# EasyEDA Pro project ESP32S3系统板+扩展板.epro

# Schematic Schematic1
Board Name: Board1; Create Date: 2025-07-21; Page Name: P1; Project Name: ESP32S3开发板; Schematic Name: Schematic1; Update Date: 2025-07-21; Company: 嘉立创EDA; Page Size: A4; Version: V1.0
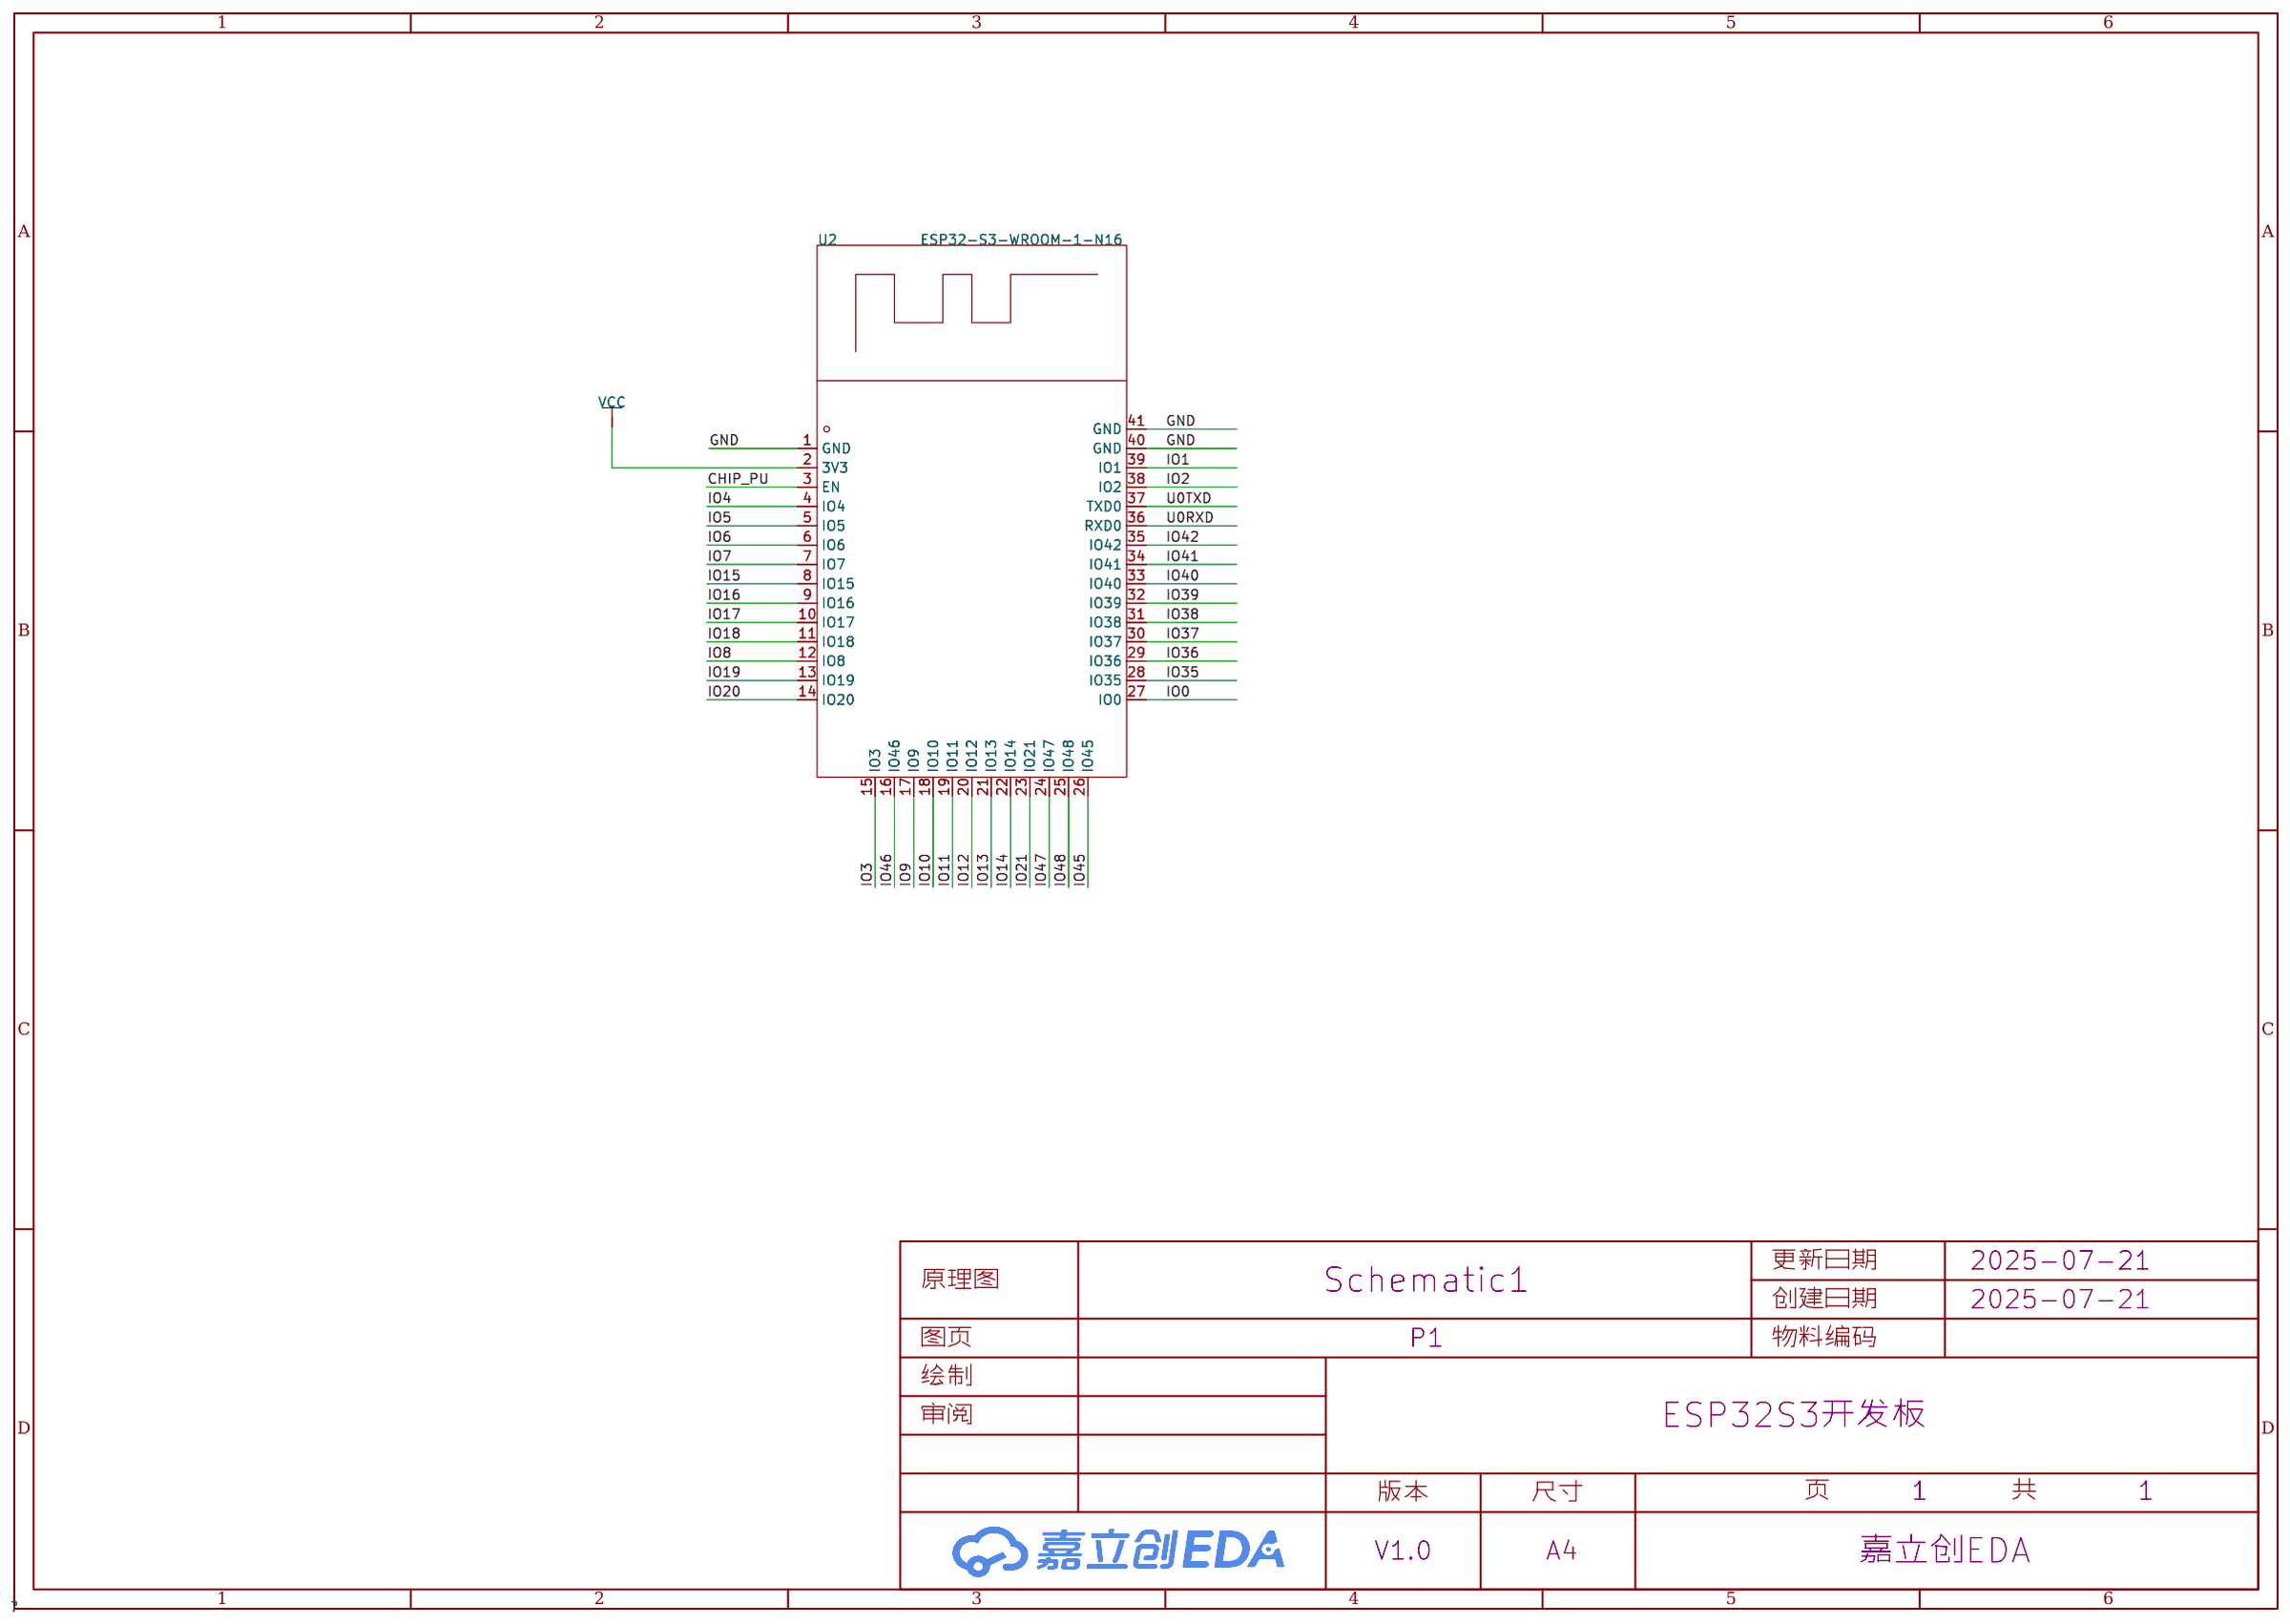
[diagram p0: schematic sheet]

## Parts
U2  ESP32-S3-WROOM-1-N16  [WIRELM-SMD_ESP32-S3-WROOM-1]

## Library data of the parts
U2 = ESP32-S3-WROOM-1-N16: LCSC Part Name: 通用型Wi-Fi+低功耗蓝牙MCU模组; Supplier Part: C2913199; Manufacturer: ESPRESSIF(乐鑫); Supplier Footprint: SMD,18x25.5mm; JLCPCB Part Class: 扩展库; Datasheet: https://atta.szlcsc.com/upload/public/pdf/source/20241030/6A412B13087E1327DF6279F5735253CA.pdf; Supplier: LCSC

## Nets
GND: U2.1(GND) U2.40(GND) U2.41(GND)
VCC: U2.2(3V3)
CHIP_PU: U2.3(EN)
IO0: U2.27(IO0)
IO1: U2.39(IO1)
IO2: U2.38(IO2)
IO3: U2.15(IO3)
IO4: U2.4(IO4)
IO5: U2.5(IO5)
IO6: U2.6(IO6)
IO7: U2.7(IO7)
IO8: U2.12(IO8)
IO9: U2.17(IO9)
IO10: U2.18(IO10)
IO11: U2.19(IO11)
IO12: U2.20(IO12)
IO13: U2.21(IO13)
IO14: U2.22(IO14)
IO15: U2.8(IO15)
IO16: U2.9(IO16)
IO17: U2.10(IO17)
IO18: U2.11(IO18)
IO19: U2.13(IO19)
IO20: U2.14(IO20)
IO21: U2.23(IO21)
IO35: U2.28(IO35)
IO36: U2.29(IO36)
IO37: U2.30(IO37)
IO38: U2.31(IO38)
IO39: U2.32(IO39)
IO40: U2.33(IO40)
IO41: U2.34(IO41)
IO42: U2.35(IO42)
IO45: U2.26(IO45)
IO46: U2.16(IO46)
IO47: U2.24(IO47)
IO48: U2.25(IO48)
U0RXD: U2.36(RXD0)
U0TXD: U2.37(TXD0)

# Schematic Schematic2
Board Name: ESP32S3扩展板; Create Date: 2025-08-27; Page Name: P1; Project Name: ESP32S3开发板; Schematic Name: Schematic2; Update Date: 2025-09-07; Company: 嘉立创EDA; Page Size: A4; Version: V1.0
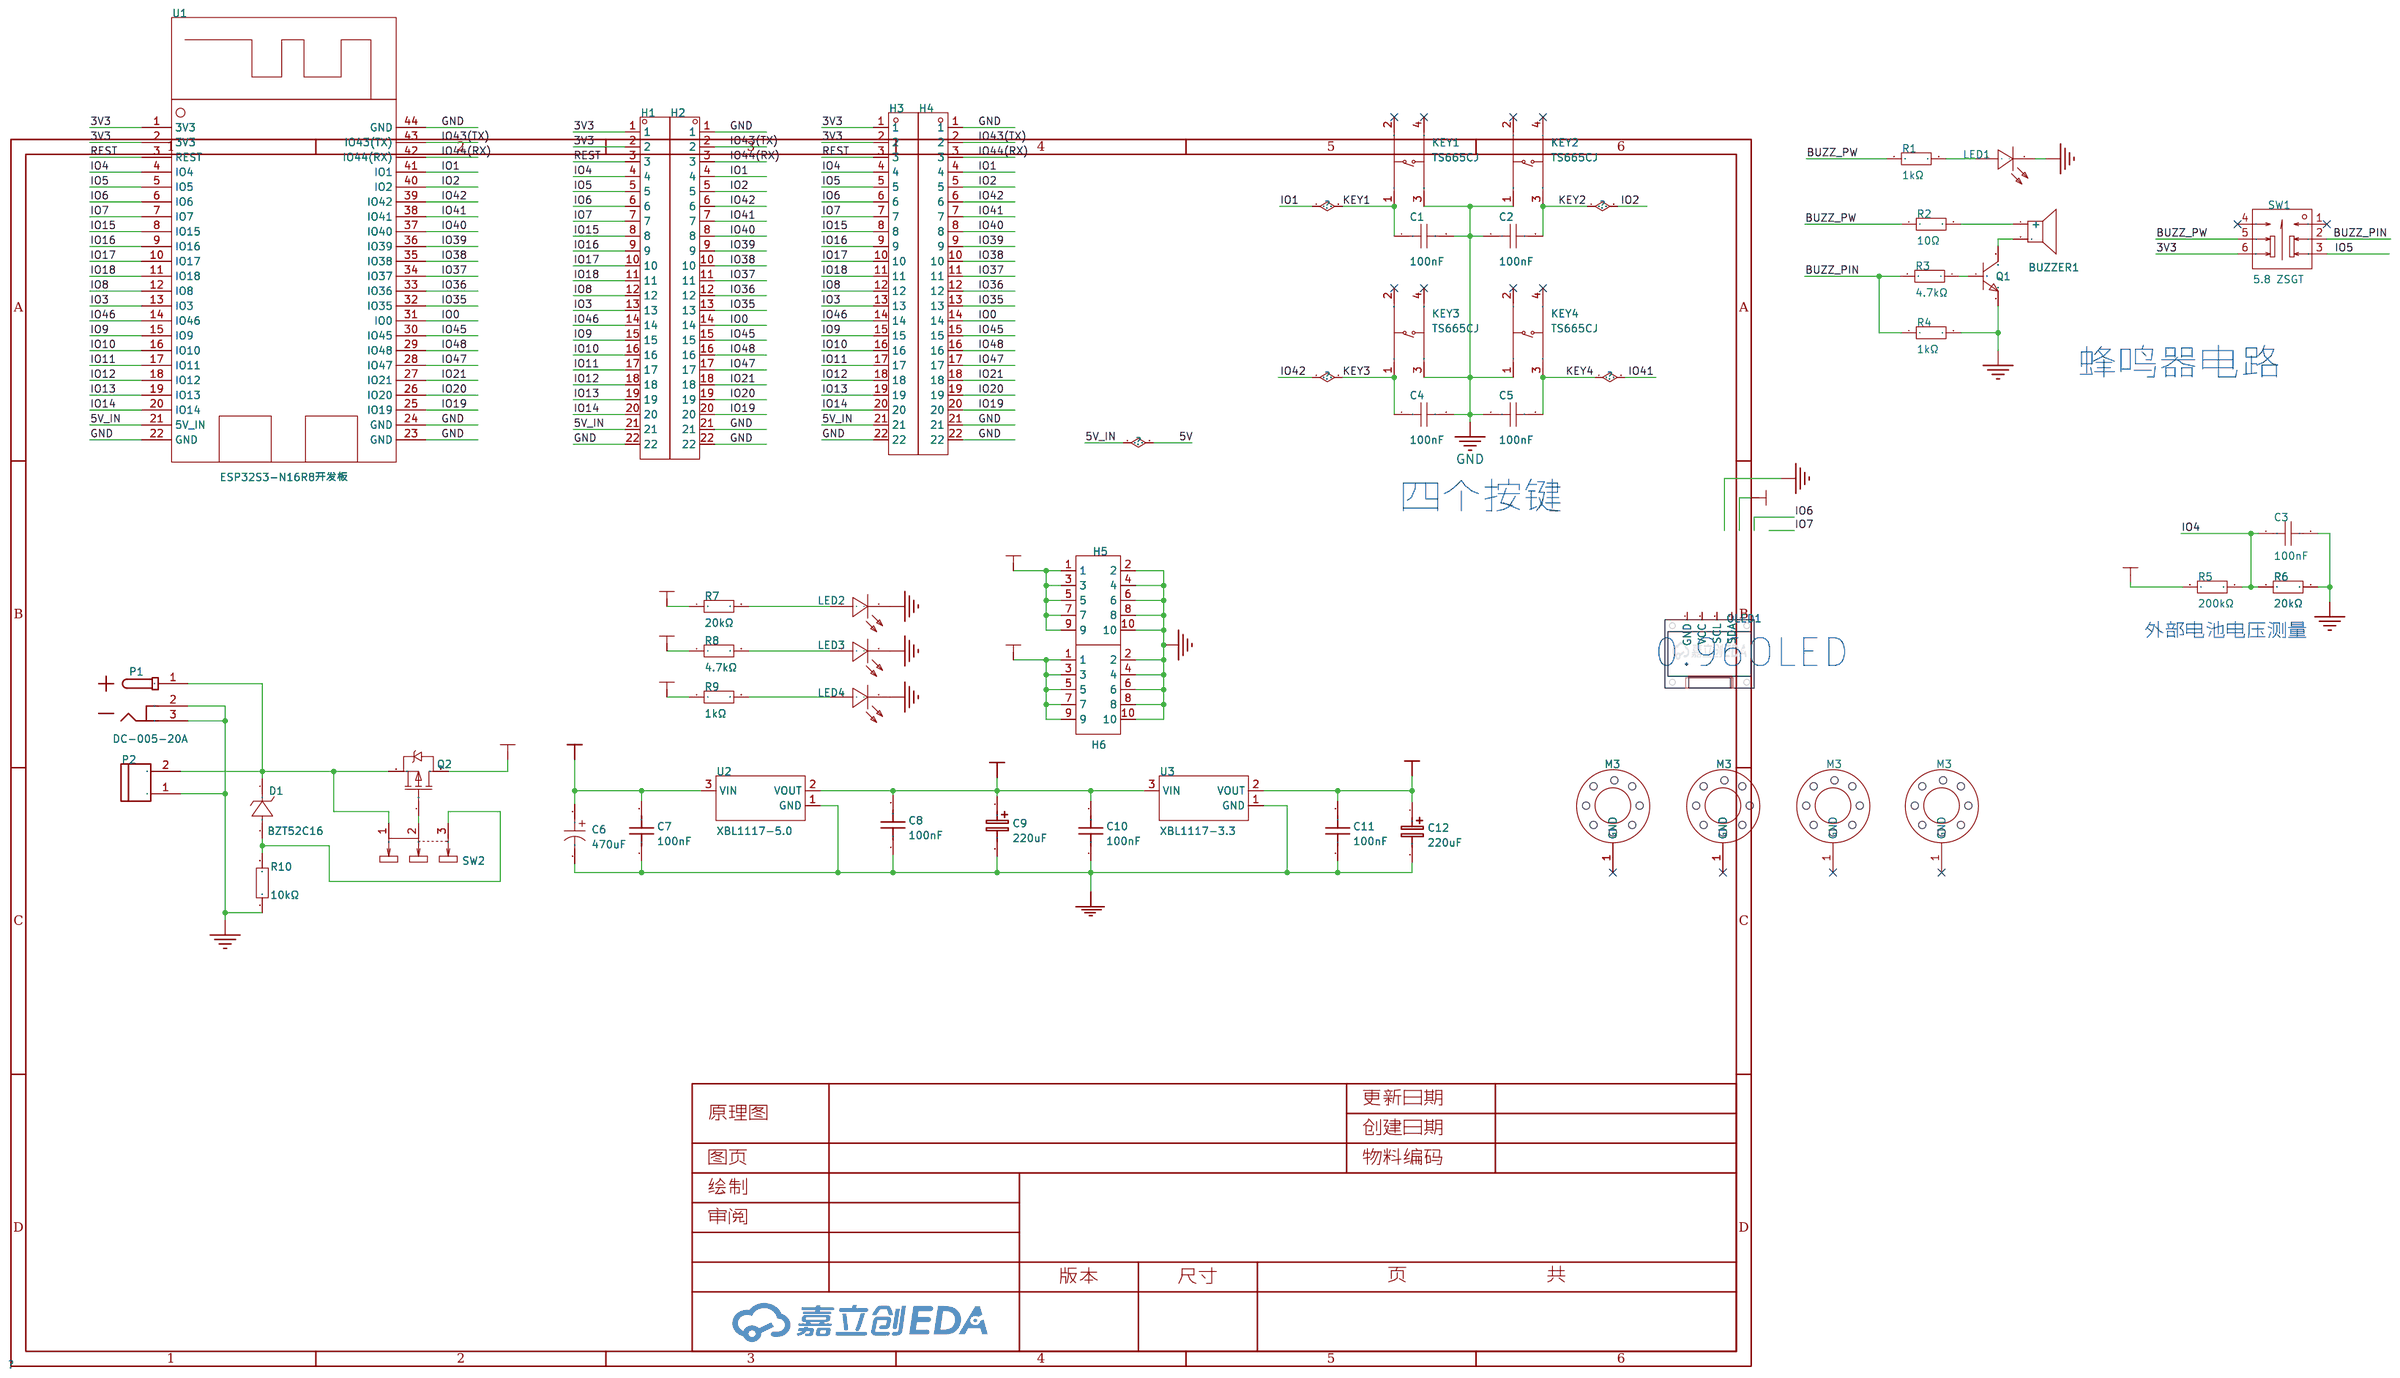
[diagram p1: schematic sheet]

## Parts
BUZZER1  2.4kHz  [BUZ-TH_BD12.0-P7.60-D0.6-FD]
C1  100nF  [C0603]
C2  100nF  [C0603]
C3  100nF  [C0603]
C4  100nF  [C0603]
C5  100nF  [C0603]
C6  470uF  [CAP-SMD_BD8.0-L8.3-W8.3-LS9.2-FD-H10.5]
C7  100nF  [C0805]
C8  100nF  [C0805]
C9  220uF  [CAP-SMD_BD6.3-L6.6-W6.6-FD]
C10  100nF  [C0805]
C11  100nF  [C0805]
C12  220uF  [CAP-SMD_BD6.3-L6.6-W6.6-FD]
D1  BZT52C16  [SOD-123_L2.7-W1.6-LS3.7-RD]
H1  CS-1165SDIG-1*22  [HDR-TH_22P-P2.54-V-F]
H2  CS-1165SDIG-1*22  [HDR-TH_22P-P2.54-V-F]
H3  HC-PZ254-11.5L-1x22PZ  [HDR-TH_22P-P2.54-V-M]
H4  HC-PZ254-11.5L-1x22PZ  [HDR-TH_22P-P2.54-V-M]
H5  PZ254V-12-10P  [HDR-TH_10P-P2.54-V-M-R2-C5-S2.54]
H6  PZ254V-12-10P  [HDR-TH_10P-P2.54-V-M-R2-C5-S2.54]
hole1  M3  [m3梅花孔]
hole2  M3  [m3梅花孔]
hole3  M3  [m3梅花孔]
hole4  M3  [m3梅花孔]
KEY1  TS665CJ  [SW-TH_4P-L6.0-W6.0-P4.50-LS6.5]
KEY2  TS665CJ  [SW-TH_4P-L6.0-W6.0-P4.50-LS6.5]
KEY3  TS665CJ  [SW-TH_4P-L6.0-W6.0-P4.50-LS6.5]
KEY4  TS665CJ  [SW-TH_4P-L6.0-W6.0-P4.50-LS6.5]
LED1  NCD0805R1  [LED0805-R-RD]
LED2  NCD0805R1  [LED0805-R-RD]
LED3  NCD0805R1  [LED0805-R-RD]
LED4  NCD0805R1  [LED0805-R-RD]
OLED1  -  [0.96OLED_4P]
P1  DC-005-20A  [DC-IN-TH_DC005]
P2  WJ301V-5.0-2P  [CONN-TH_2P-P5.00_WJ301V-5.00-2P]
Q1  MMS8050-H-TP  [SOT-23-3_L2.9-W1.3-P1.90-LS2.4-BR]
Q2  HY19P03D  [TO-252-2_L6.6-W6.1-P4.57-LS9.9-TL-CW]
R1  1kΩ  [R0805]
R2  10Ω  [R0603]
R3  4.7kΩ  [R0603]
R4  1kΩ  [R0603]
R5  200kΩ  [R0603]
R6  20kΩ  [R0603]
R7  20kΩ  [R0805]
R8  4.7kΩ  [R0805]
R9  1kΩ  [R0805]
R10  10kΩ  [R0805]
SW1  5.8 ZSGT  [SW-TH_5.8ZSGT]
SW2  SS-12D10L5  [SW-TH_SS-12D10L5]
U1  ESP32S3-N16R8开发板  [ESP32S3-N16R8开发板(优信)]
U2  XBL1117-5.0  [SOT-223-3_L6.7-W3.7-P2.30-LS7.0-BR_2]
U3  XBL1117-3.3  [SOT-223-3_L6.7-W3.7-P2.30-LS7.0-BR_2]

## Library data of the parts
BUZZER1 = TMB12A05_C96093: 驱动方式:有源(内含驱动线路);构造类型:电磁式;额定电压:-;频率:2.4kHz;声压(SPL):85dB;; LCSC Part Name: TMB12A05; Supplier Part: C96093; Manufacturer: 华能; Manufacturer Part: TMB12A05; Supplier Footprint: 插件,D=12mm; JLCPCB Part Class: Extended Part; Datasheet: https://atta.szlcsc.com/upload/public/pdf/source/20241025/8A17FE04D767D19A35A06DEF9A82AB1E.pdf; Supplier: LCSC; Oscillator Circuit: 有源(内含驱动线路); Technology Type: 电磁式; Operating Voltage: 4V~8V; Sound Pressure Level (SPL): 85dB; Diameter (φD): 12mm; Height: 9.8mm; Driver Circuitry: 有源(内含驱动线路); Technology: 电磁式; Voltage - Supply: 4V~8V; Sound Pressure Level(SPL): 85dB; Diameter(φD): 12mm
C1 C2 C4 C5 = CGA0603X7R104K500JT: 容值:100nF;精度:±10%;额定电压:50V;温度系数:X7R;; LCSC Part Name: 100nF ±10% 50V; Supplier Part: C6119867; Manufacturer: HRE(芯声); Supplier Footprint: 0603; JLCPCB Part Class: Extended Part; Datasheet: https://atta.szlcsc.com/upload/public/pdf/source/20250103/C44077DA9E7B3EFAE02F22B6D3D1CBC9.pdf; Supplier: LCSC; Tolerance: ±10%; Voltage Rating: 50V; Temperature Coefficient: X7R
C3 = CGA0603X7R104K500JT: 容值:100nF;精度:±10%;额定电压:50V;温度系数:X7R;; LCSC Part Name: 100nF ±10% 50V; Supplier Part: C6119867; Manufacturer: HRE(芯声); Supplier Footprint: 0603; JLCPCB Part Class: Extended Part; Datasheet: https://atta.szlcsc.com/upload/public/pdf/source/20250103/C44077DA9E7B3EFAE02F22B6D3D1CBC9.pdf; Supplier: LCSC; Tolerance: ±10%; Voltage Rating: 50V; Temperature Coefficient: X7R; Voltage Rated: 50V
C6 = JVJ25V470M8x10: 容值:470uF;精度:±20%;额定电压:25V;纹波电流:240mA@120Hz;; LCSC Part Name: 470uF ±20% 25V; Supplier Part: C46550407; Manufacturer: 捷而瑞; Supplier Footprint: SMD,D8xL10.5mm; JLCPCB Part Class: Extended Part; Datasheet: https://atta.szlcsc.com/upload/public/pdf/source/20250526/372E583B5965CEB57A276EA554306514.pdf; Supplier: LCSC; Tolerance: ±20%; Voltage Rating: 25V; Ripple Current: 240mA@120Hz; Diameter: 8mm; Height - Seated (Max): 10mm; Lifetime: 2000hrs@105℃; Operating Temperature: -55℃~+105℃
C7 C8 C10 C11 = CC0805KRX7R9BB104: 容值:100nF;精度:±10%;额定电压:50V;材质(温度系数):X7R;; LCSC Part Name: 100nF ±10% 50V; Supplier Part: C49678; Manufacturer: YAGEO(国巨); Supplier Footprint: 0805; JLCPCB Part Class: Basic Part; Datasheet: https://atta.szlcsc.com/upload/public/pdf/source/20180224/C181747_15194369449651363981.pdf; Supplier: LCSC; Tolerance: ±10%; Voltage Rated: 50V; Temperature Coefficient: X7R
C9 C12 = RST220UF10V018: 容值:220uF;精度:±20%;额定电压:10V;纹波电流:85mA@120Hz;等效串联电阻(ESR):-;; LCSC Part Name: 220uF ±20% 10V; Supplier Part: C4747973; Manufacturer: KNSCHA(科尼盛); Supplier Footprint: SMD,D6.3xL5.4mm; JLCPCB Part Class: Extended Part; Datasheet: https://atta.szlcsc.com/upload/public/pdf/source/20220722/AD247F0826B90D1CD53BDFA96956336C.pdf; Supplier: LCSC; Tolerance: ±20%; Voltage Rating: 10V; Ripple Current: 85mA@120Hz; Diameter: 6.3mm; Height - Seated (Max): 5.4mm; Lifetime: 2000hrs@105℃; Operating Temperature: -40℃~+105℃
D1 = BZT52C16_C19077413: 二极管配置:独立式;稳压值(标称值):16V;稳压值(范围):15.2V~16.8V;功率(Pd):500mW;; Supplier Part: C19077413; Manufacturer: 宏迦橙; Supplier Footprint: SOD-123; JLCPCB Part Class: 扩展库; Datasheet: https://atta.szlcsc.com/upload/public/pdf/source/20231117/6E01C14CCA1A38C68A5225952E4BCE14.pdf; Supplier: LCSC; Diode Configuration: 独立式; Zener Voltage (Nom): 16V; Reverse Leakage Current (Ir): 100nA@11.2V; Zener Voltage (Range): 15.2V~16.8V; Power Dissipation: 500mW; Zener Impedance (Zzt): 45Ω
H1 H2 = CS-1165SDIG-1*22: 插孔结构:1x22P;间距:2.54mm;行距:-;圆孔/方孔:方孔;安装方式:直插;排数:单排;总孔位数:22P;额定电流:3A;额定电压:250V;插孔方向:顶部;塑高:8.5mm;工作温度:-40℃~+105℃;; LCSC Part Name: 间距:2.54mm 1x22P 直插; Supplier Part: C2886702; Manufacturer: CST(永丰盈); Supplier Footprint: 插件,P=2.54mm; JLCPCB Part Class: 扩展库; Datasheet: https://item.szlcsc.com/datasheet/CS-1165SDIG-1*22/3101052.html; Supplier: LCSC; Holes Structure: 1x22P; Pitch: 2.54mm; Circular Hole / Square Hole: 方孔; Mounting Type: 直插; Number of Rows: 单排; Number of Positions: 22P; Current Rating: 3A; Voltage Rating (Max): 250V; Holes Direction: 顶部; Insulation Height: 8.5mm; Operating Temperature: -40℃~+105℃
H3 H4 = HC-PZ254-11.5L-1x22PZ: 插针结构:1x22P;间距:2.54mm;行距:-;圆针/方针:方针;安装方式:直插;排数:单排;总PIN位数:22P;额定电流:3A;额定电压:-;配合针长度:6mm;塑高:2.5mm;端接针长度:3mm;触头材质:黄铜;触头镀层:金;工作温度:-40℃~+105℃;颜色:黑色;; LCSC Part Name: 1x22P 间距:2.54mm 方针 直插; Supplier Part: C41375941; Manufacturer: HC(虹成电子); Supplier Footprint: 插件,P=2.54mm; Datasheet: https://item.szlcsc.com/datasheet/HC-PZ254-11.5L-1x22PZ/43143790.html; Supplier: LCSC; Pin Structure: 1x22P; Pitch: 2.54mm; Circluar Pins/Square Pins: 方针; Mounting Type: 直插; Number of Rows: 单排; Number of Pins: 22P; Current Rating: 3A; Length of Mating Pin: 6mm; Insulation Height: 2.5mm; Length of End Connection Pin: 3mm; Contact Material: 黄铜; Contact Plating: 金; Operating Temperature: -40℃~+105℃; Color: 黑色
H5 H6 = PZ254V-12-10P: 插针结构:2x5P;间距:2.54mm;行距:2.54mm;圆针/方针:方针;安装方式:直插;排数:双排;总PIN位数:10P;额定电流:-;额定电压:-;配合针长度:6mm;塑高:2.5mm;端接针长度:3mm;触头材质:黄铜;触头镀层:-;工作温度:-40℃~+105℃;颜色:黑色;; LCSC Part Name: 2x5P 间距:2.54mm 方针 直插; Supplier Part: C492422; Manufacturer: XFCN(兴飞); Supplier Footprint: 插件,P=2.54mm; JLCPCB Part Class: 扩展库; Datasheet: https://item.szlcsc.com/datasheet/PZ254V-12-10P/502978.html; Supplier: LCSC; Pin Structure: 2x5P; Pitch: 2.54mm; Row Spacing: 2.54mm; Circluar Pins/Square Pins: 方针; Mounting Type: 直插; Number of Rows: 双排; Number of Pins: 10P; Length of Mating Pin: 6mm; Insulation Height: 2.5mm; Length of End Connection Pin: 3mm; Contact Material: 黄铜; Operating Temperature: -40℃~+105℃; Color: 黑色
hole1-hole4 = m3_梅花螺丝孔: 梅花螺丝孔
KEY1-KEY4 = TS665CJ: 电路结构:单刀单掷;按钮形状:圆形按钮;安装方式:直插;开关长度:6mm;开关宽度:6mm;开关高度:5mm;触点电流:50mA;额定电压(DC):12V;带灯:-;机械寿命:-;; LCSC Part Name: 6*6*5mm 直插 轻触开关; Supplier Part: C393938; Manufacturer: SHOU HAN(首韩); Supplier Footprint: 插件; JLCPCB Part Class: Extended Part; Datasheet: https://atta.szlcsc.com/upload/public/pdf/source/20190521/C393938_BDABEAC600B4C55E200A80AA129B70BC.pdf; Supplier: LCSC; Circuit: 单刀单掷; Actuator Style: 圆形按钮; Mounting Style: 直插; Switch Length: 6mm; Switch Width: 6mm; Switch Height: 5mm; Contact Current: 50mA; Voltage Rating (DC): 12V
LED1-LED4 = NCD0805R1: 灯头类型:-;发光颜色:红色;正向电压(VF):1.6V~2.6V;功率:65mW;正向电流:20mA;主波长:615nm~630nm;二极管配置:独立二极管;透镜颜色:无色透明透镜;色温:-;发光强度:67mcd~195mcd;发光角度:130°;载带方式:-;工作温度:-30℃~+85℃;; Supplier Part: C84256; Manufacturer: 国星光电; Supplier Footprint: 0805; JLCPCB Part Class: Basic Part; Datasheet: https://atta.szlcsc.com/upload/public/pdf/source/20200820/C84256_F0A75A43B3EAD75808600A0514C76B99.pdf; Supplier: LCSC; Emitted Color: 红色; Forward Voltage (VF): 1.6V~2.6V; Power Dissipation: 65mW; Forward Current: 20mA; Dominant Wavelength: 615nm~630nm; Diode Configuration: 独立二极管; Lens Color: 无色透明透镜; Luminous Intensity: 67mcd~195mcd; Viewing Angle: 130°; Operating Temperature: -30℃~+85℃
OLED1 = 0.96OLED模块_4P: Supplier Footprint: 插件
P1 = DC-005-20A: 连接器类型:DC电源插座;安装方式:弯插;触点内径:2mm;触点外径:6.4mm;额定电流:500mA;额定电压:30V;工作温度:-25℃~+80℃;; LCSC Part Name: DC电源插座 内径:2mm 外径:6.4mm; Supplier Part: C130239; Manufacturer: 韩国韩荣; Supplier Footprint: 插件; JLCPCB Part Class: Extended Part; Datasheet: https://atta.szlcsc.com/upload/public/pdf/source/20210810/D1FE451D887B1804F0660F580C4AD849.pdf; Supplier: LCSC; Connector Type: DC电源插座; Mounting Type: 弯插; Inside Contact Diameter: 2mm; Outside Contact Diameter: 6.4mm; Current Rating: 500mA; Voltage Rating (Max): 30V; Operating Temperature: -25℃~+80℃
P2 = WJ301V-5.0-2P: 结构:1x2P;间距:5mm;颜色:蓝色;安装方式:直插;额定电流:17.5A;额定电压:250V;排数:1;线规 - AWG:14~22;线规 - 平方毫米:1.5;每排PIN数:2;工作温度范围:-30℃~+120℃;; LCSC Part Name: 5mm 1x2P 排数:1 每排P数:2 直插; Supplier Part: C8475; Manufacturer: KANGNEX(康奈克斯电气); Supplier Footprint: 插件,P=5mm; JLCPCB Part Class: Extended Part; Datasheet: https://atta.szlcsc.com/upload/public/pdf/source/20191225/C8475_44061C6AEE590DF3BFA2B6A28FAAB4F6.pdf; Supplier: LCSC; Structure: 1x2P; Pitch: 5mm; Color: 蓝色; Mounting Style: 直插; Current Rating (Max): 17.5A; Voltage Rating (Max): 250V; Number of Pins: 2P; Number of Rows: 1; Wire Gauge - AWG: 14~22; Wire Gauge - mm2: 1.5; Number of PINs Per Row: 2; Operating Temperature Range: -30℃~+120℃
Q1 = MMS8050-H-TP: 晶体管类型:NPN;集电极电流(Ic):500mA;集射极击穿电压(Vceo):25V;功率(Pd):300mW;直流电流增益(hFE@Ic,Vce):120@50mA,1V;; LCSC Part Name: 耐压:25V 电流:500mA NPN; Supplier Part: C668971; Manufacturer: MCC(美微科); Supplier Footprint: SOT-23; JLCPCB Part Class: 扩展库; Datasheet: https://atta.szlcsc.com/upload/public/pdf/source/20200618/C668971_E8C4278A0C61D2294D468F2197C24659.pdf; Supplier: LCSC; Transistor Type: NPN; Collector Current (Ic): 500mA; Collector-Emitter Breakdown Voltage (Vceo): 25V; Power Dissipation (Pd): 300mW; DC Current Gain (hFE@Ic,Vce): 120@50mA,1V; Transition Frequency (fT): 150MHz; Collector Cut-Off Current (Icbo): 100nA; Collector-Emitter Saturation Voltage (VCE(sat)@Ic,Ib): 600mV@500mA,50mA; Operating Temperature: -55℃~+150℃@(Tj)
Q2 = HY19P03D: 类型:P沟道;漏源电压(Vdss):30V;连续漏极电流(Id):90A;功率(Pd):50W;导通电阻(RDS(on)@Vgs,Id):6mΩ@10V,45A;阈值电压(Vgs(th)@Id):3V@250uA;; LCSC Part Name: P沟道 耐压:30V 电流:90A; Supplier Part: C122492; Manufacturer: HUAYI(华羿微); Supplier Footprint: TO-252-2; JLCPCB Part Class: 扩展库; Datasheet: https://atta.szlcsc.com/upload/public/pdf/source/20170728/C122492_1501225751911848809.pdf; Supplier: LCSC; Type: P沟道; Drain Source Voltage (Vdss): 30V; Continuous Drain Current (Id): 90A; Power Dissipation (Pd): 50W; Drain Source On Resistance (RDS(on)@Vgs,Id): 6mΩ@10V,45A; Gate Threshold Voltage (Vgs(th)@Id): 3V@250uA
R1 R9 = 0805W8F1001T5E: 电阻类型:厚膜电阻;阻值:1kΩ;精度:±1%;功率:125mW;最大工作电压:150V;温度系数:±100ppm/℃;; LCSC Part Name: 1kΩ ±1% 125mW 厚膜电阻; Supplier Part: C17513; Manufacturer: UNI-ROYAL(厚声); Supplier Footprint: 0805; JLCPCB Part Class: 基础库; Datasheet: https://atta.szlcsc.com/upload/public/pdf/source/20200306/C422600_1E6D84923E4A46A82E41ADD87F860B5C.pdf; Supplier: LCSC; Type: 厚膜电阻; Tolerance: ±1%; Power(Watts): 125mW; Overload Voltage (Max): 150V; Temperature Coefficient: ±100ppm/℃; Operating Temperature Range: -55℃~+155℃
R2 = 0603WAF100JT5E: 电阻类型:厚膜电阻;阻值:10Ω;精度:±1%;功率:100mW;最大工作电压:75V;温度系数:±400ppm/℃;; LCSC Part Name: 10Ω ±1% 100mW 厚膜电阻; Supplier Part: C22859; Manufacturer: UNI-ROYAL(厚声); Supplier Footprint: 0603; JLCPCB Part Class: 基础库; Datasheet: https://atta.szlcsc.com/upload/public/pdf/source/20200306/C422600_1E6D84923E4A46A82E41ADD87F860B5C.pdf; Supplier: LCSC; Type: 厚膜电阻; Tolerance: ±1%; Power(Watts): 100mW; Overload Voltage (Max): 75V; Temperature Coefficient: ±400ppm/℃; Operating Temperature Range: -55℃~+155℃
R3 = 0603WAF4701T5E: 电阻类型:厚膜电阻;阻值:4.7kΩ;精度:±1%;功率:100mW;最大工作电压:75V;温度系数:±100ppm/℃;; LCSC Part Name: 4.7kΩ ±1% 100mW 厚膜电阻; Supplier Part: C23162; Manufacturer: UNI-ROYAL(厚声); Supplier Footprint: 0603; JLCPCB Part Class: 基础库; Datasheet: https://atta.szlcsc.com/upload/public/pdf/source/20200306/C422600_1E6D84923E4A46A82E41ADD87F860B5C.pdf; Supplier: LCSC; Type: 厚膜电阻; Tolerance: ±1%; Power(Watts): 100mW; Overload Voltage (Max): 75V; Temperature Coefficient: ±100ppm/℃; Operating Temperature Range: -55℃~+155℃
R4 = 0603WAF1001T5E: 电阻类型:厚膜电阻;阻值:1kΩ;精度:±1%;功率:100mW;最大工作电压:75V;温度系数:±100ppm/℃;; LCSC Part Name: 1kΩ ±1% 100mW 厚膜电阻; Supplier Part: C21190; Manufacturer: UNI-ROYAL(厚声); Supplier Footprint: 0603; JLCPCB Part Class: 基础库; Datasheet: https://atta.szlcsc.com/upload/public/pdf/source/20200306/C422600_1E6D84923E4A46A82E41ADD87F860B5C.pdf; Supplier: LCSC; Type: 厚膜电阻; Tolerance: ±1%; Power(Watts): 100mW; Overload Voltage (Max): 75V; Temperature Coefficient: ±100ppm/℃; Operating Temperature Range: -55℃~+155℃
R5 = 0603WAF2003T5E: 电阻类型:厚膜电阻;阻值:200kΩ;精度:±1%;功率:100mW;最大工作电压:75V;温度系数:±100ppm/℃;; LCSC Part Name: 200kΩ ±1% 100mW 厚膜电阻; Supplier Part: C25811; Manufacturer: UNI-ROYAL(厚声); Supplier Footprint: 0603; JLCPCB Part Class: 基础库; Datasheet: https://atta.szlcsc.com/upload/public/pdf/source/20200306/C422600_1E6D84923E4A46A82E41ADD87F860B5C.pdf; Supplier: LCSC; Type: 厚膜电阻; Tolerance: ±1%; Power(Watts): 100mW; Overload Voltage (Max): 75V; Temperature Coefficient: ±100ppm/℃; Operating Temperature Range: -55℃~+155℃
R6 = 0603WAF2002T5E: 电阻类型:厚膜电阻;阻值:20kΩ;精度:±1%;功率:100mW;最大工作电压:75V;温度系数:±100ppm/℃;; LCSC Part Name: 20kΩ ±1% 100mW 厚膜电阻; Supplier Part: C4184; Manufacturer: UNI-ROYAL(厚声); Supplier Footprint: 0603; JLCPCB Part Class: 基础库; Datasheet: https://atta.szlcsc.com/upload/public/pdf/source/20200306/C422600_1E6D84923E4A46A82E41ADD87F860B5C.pdf; Supplier: LCSC; Type: 厚膜电阻; Tolerance: ±1%; Power(Watts): 100mW; Overload Voltage (Max): 75V; Temperature Coefficient: ±100ppm/℃; Operating Temperature Range: -55℃~+155℃
R7 = RMC 0805 20K F N: 电阻类型:厚膜电阻;阻值:20kΩ;精度:±1%;功率:125mW;工作电压:150V;温度系数:±100ppm/℃;; LCSC Part Name: 20kΩ ±1% 125mW; Supplier Part: C325760; Manufacturer: Tyohm(幸亚电阻); Supplier Footprint: 0805; JLCPCB Part Class: 扩展库; Datasheet: https://item.szlcsc.com/datasheet/RMC%25200805%252020K%2520F%2520N/305965.html; Supplier: LCSC; Type: 厚膜电阻; Tolerance: ±1%; Power(Watts): 125mW; Voltage-Supply(Max): 150V; Temperature Coefficient: ±100ppm/℃; Operating Temperature: -55℃~+155℃
R8 = 0805W8F4701T5E: 电阻类型:厚膜电阻;阻值:4.7kΩ;精度:±1%;功率:125mW;最大工作电压:150V;温度系数:±100ppm/℃;; LCSC Part Name: 4.7kΩ ±1% 125mW 厚膜电阻; Supplier Part: C17673; Manufacturer: UNI-ROYAL(厚声); Supplier Footprint: 0805; JLCPCB Part Class: 基础库; Datasheet: https://atta.szlcsc.com/upload/public/pdf/source/20200306/C422600_1E6D84923E4A46A82E41ADD87F860B5C.pdf; Supplier: LCSC; Type: 厚膜电阻; Tolerance: ±1%; Power(Watts): 125mW; Overload Voltage (Max): 150V; Temperature Coefficient: ±100ppm/℃; Operating Temperature Range: -55℃~+155℃
R10 = 0805W8J0103T5E: 电阻类型:厚膜电阻;阻值:10kΩ;精度:±5%;功率:125mW;最大工作电压:150V;温度系数:±100ppm/℃;; LCSC Part Name: 10kΩ ±5% 125mW 厚膜电阻; Supplier Part: C25612; Manufacturer: UNI-ROYAL(厚声); Supplier Footprint: 0805; JLCPCB Part Class: 扩展库; Datasheet: https://atta.szlcsc.com/upload/public/pdf/source/20200306/C422600_1E6D84923E4A46A82E41ADD87F860B5C.pdf; Supplier: LCSC; Type: 厚膜电阻; Tolerance: ±5%; Power(Watts): 125mW; Overload Voltage (Max): 150V; Temperature Coefficient: ±100ppm/℃; Operating Temperature Range: -55℃~+155℃
SW1 = 5.8 ZSGT: 电路结构:双刀双掷;自锁/无锁:自锁;安装方式:直插;触点电流:110mA;额定电压 (DC):30V;带灯:不带;作用力:1.5N;机械寿命:10万次;; LCSC Part Name: 5.8*5.8有头/高头 带锁/自锁开关 泡泡机开关; Supplier Part: C2681587; Manufacturer: SHOU HAN(首韩); Supplier Footprint: 插件; JLCPCB Part Class: 扩展库; Datasheet: https://atta.szlcsc.com/upload/public/pdf/source/20210107/C2681587_CDDDDA4A1C7AC9FEB01815B75893A6BA.pdf; Supplier: LCSC; Circuit: 双刀双掷; Self Lock / No Lock: 自锁; Actuator Style: 方形按钮; Mounting Style: 直插; Contact Current: 110mA; Voltage Rating (DC): 30V; Insulation Resistance: 100MΩ; Actuator/Cap Color: 白色; With Lamp: 不带; Pin Style: PC引脚; Operating Force: 1.5N; Operating Temperature: -10℃~+70℃; Mechanical Life: 10万次
SW2 = SS-12D10L5: 电路结构:单刀双掷;安装方式:直插;开关颜色:黑色;额定电流(DC):3A;额定电压(DC):125V;额定电流(AC):3A;额定电压(AC):125V;机械寿命:1万次;; LCSC Part Name: 柄长5mm 直插双档 滑动开关; Supplier Part: C319012; Manufacturer: XKB Connectivity(中国星坤); Supplier Footprint: 插件; JLCPCB Part Class: 扩展库; Datasheet: https://atta.szlcsc.com/upload/public/pdf/source/20211009/D6412F37AABE6F9459A6EE7FA4DAEADB.pdf; Supplier: LCSC; Circuit: 单刀双掷; Actuator Style: 矩形柱状; Pin Style: PC引脚; Switch Length: 13mm; Switch Width: 6.8mm; Switch Height: 6.4mm; Mounting Style: 直插; Actuator Color: 黑色; Current Rating (DC): 3A; Voltage Rating (DC): 125V; Current Rating (AC): 3A; Voltage Rating (AC): 125V; Mechanical Life: 1万次; Operating Temperature: -40℃~+85℃
U1 = ESP32S3-N16R8开发板(优信)
U2 = XBL1117-5.0: 输出类型:固定;工作电压:15V;输出电压:5V;输出电流:1A;电源纹波抑制比(PSRR):-;输出极性:正极;; LCSC Part Name: XBL1117-5.0是一款正电压输出的低压降三端线性稳压电路,固定输出电压5.0V。; Supplier Part: C47021215; Manufacturer: XBLW(芯伯乐); Supplier Footprint: SOT-223; JLCPCB Part Class: 扩展库; Datasheet: https://atta.szlcsc.com/upload/public/pdf/source/20241105/99A61E3A19B1D6C2E2293404E0A66EE2.pdf; Supplier: LCSC; Output Type: 固定; Voltage - Supply: 15V; Output Voltage: 5V; Output Current: 1A; standby current: 4mA; Features: 短路保护；过压保护; Operating Temperature: -40℃~+125℃@(Ta); Output Configuration: 正极
U3 = XBL1117-3.3: 输出类型:固定;工作电压:15V;输出电压:3.3V;输出电流:1A;电源纹波抑制比(PSRR):-;输出极性:正极;; LCSC Part Name: XBL1117-3.3 是一款正电压输出的低压降三端线性稳压电路,固定输出电压3.3V。; Supplier Part: C47021214; Manufacturer: XBLW(芯伯乐); Supplier Footprint: SOT-223; JLCPCB Part Class: 扩展库; Datasheet: https://atta.szlcsc.com/upload/public/pdf/source/20241105/99A61E3A19B1D6C2E2293404E0A66EE2.pdf; Supplier: LCSC; Output Type: 固定; Voltage - Supply: 15V; Output Voltage: 3.3V; Output Current: 1A; standby current: 4mA; Features: 短路保护；过压保护; Operating Temperature: -40℃~+125℃@(Ta); Output Configuration: 正极; Number of Outputs: 1

## Nets
3V3: C11.2 C12.1 H1.1 H1.2 H3.1 H3.2 H6.1 H6.3 H6.5 H6.7 H6.9 R9.1 SW1.6 U1.1(3V3) U1.2(3V3) U3.2(VOUT)
5V: C8.2 C9.1 C10.2 H1.21 H3.21 H5.1 H5.3 H5.5 H5.7 H5.9 R8.1 U1.21(5V_IN) U2.2(VOUT) U3.3(VIN)
GND: C1.2 C2.1 C3.2 C4.2 C5.1 C6.2 C7.1 C8.1 C9.2 C10.1 C11.1 C12.2 H1.22 H2.1 H2.21 H2.22 H3.22 H4.1 H4.21 H4.22 H5.2 H5.4 H5.6 H5.8 H5.10 H6.2 H6.4 H6.6 H6.8 H6.10 KEY1.3(C) KEY2.1(A) KEY3.3(C) KEY4.1(A) LED1.2(-) LED2.2(-) LED3.2(-) LED4.2(-) P1.2 P1.3 P2.1 Q1.2(E) R4.2 R6.2 R10.1 U1.22(GND) U1.23(GND) U1.24(GND) U1.44(GND) U2.1(GND) U3.1(GND)
VCCBAT: C6.1 C7.2 Q2.2(D) R5.2 R7.1 U2.3(VIN)
BUZZ_PIN: R3.2 R4.1 SW1.2
BUZZ_PW: R1.1 R2.1 SW1.5
IO0: H2.14 H4.14 U1.31(IO0)
IO1: C1.1 H2.4 H4.4 KEY1.1(A) U1.41(IO1)
IO2: C2.2 H2.5 H4.5 KEY2.3(C) U1.40(IO2)
IO3: H1.13 H3.13 U1.13(IO3)
IO4: C3.1 H1.4 H3.4 R5.1 R6.1 U1.4(IO4)
IO5: H1.5 H3.5 SW1.3 U1.5(IO5)
IO6: H1.6 H3.6 U1.6(IO6)
IO7: H1.7 H3.7 U1.7(IO7)
IO8: H1.12 H3.12 U1.12(IO8)
IO9: H1.15 H3.15 U1.15(IO9)
IO10: H1.16 H3.16 U1.16(IO10)
IO11: H1.17 H3.17 U1.17(IO11)
IO12: H1.18 H3.18 U1.18(IO12)
IO13: H1.19 H3.19 U1.19(IO13)
IO14: H1.20 H3.20 U1.20(IO14)
IO15: H1.8 H3.8 U1.8(IO15)
IO16: H1.9 H3.9 U1.9(IO16)
IO17: H1.10 H3.10 U1.10(IO17)
IO18: H1.11 H3.11 U1.11(IO18)
IO19: H2.20 H4.20 U1.25(IO19)
IO20: H2.19 H4.19 U1.26(IO20)
IO21: H2.18 H4.18 U1.27(IO21)
IO35: H2.13 H4.13 U1.32(IO35)
IO36: H2.12 H4.12 U1.33(IO36)
IO37: H2.11 H4.11 U1.34(IO37)
IO38: H2.10 H4.10 U1.35(IO38)
IO39: H2.9 H4.9 U1.36(IO39)
IO40: H2.8 H4.8 U1.37(IO40)
IO41: C5.2 H2.7 H4.7 KEY4.3(C) U1.38(IO41)
IO42: C4.1 H2.6 H4.6 KEY3.1(A) U1.39(IO42)
IO43(TX): H2.2 H4.2 U1.43(IO43(TX))
IO44(RX): H2.3 H4.3 U1.42(IO44(RX))
IO45: H2.15 H4.15 U1.30(IO45)
IO46: H1.14 H3.14 U1.14(IO46)
IO47: H2.17 H4.17 U1.28(IO47)
IO48: H2.16 H4.16 U1.29(IO48)
REST: H1.3 H3.3 U1.3(REST)
$1N2876: D1.2(A) R10.2 SW2.3
$1N2878: Q2.1(G) SW2.2
$1N2879: D1.1(K) P1.1 P2.2 Q2.3(S) SW2.1
$1N8711: Q1.1(B) R3.1
$1N8713: BUZZER1.2 Q1.3(C)
$1N8714: BUZZER1.1(+) R2.2
$1N9371: LED1.1(+) R1.2
Net-(LED2-1): LED2.1(+) R7.2
Net-(LED3-1): LED3.1(+) R8.2
Net-(LED4-1): LED4.1(+) R9.2

Not connected (* = marked no-connect by the designer): hole1 1(GND)*; hole2 1(GND)*; hole3 1(GND)*; hole4 1(GND)*; KEY1 2(B)* 4(D)*; KEY2 2(B)* 4(D)*; KEY3 2(B)* 4(D)*; KEY4 2(B)* 4(D)*; OLED1 1(GND) 2(VCC) 3(SCL) 4(SDA); SW1 1* 4*

## Notes on the sheet
- 蜂鸣器电路
- 四个按键
- 外部电池电压测量
- 0.96OLED

# Board PCB1
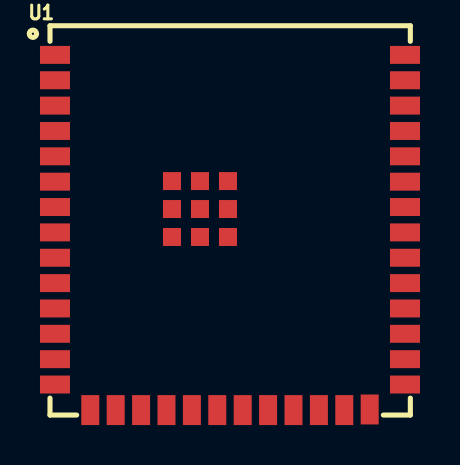
[diagram p2: board, top side]
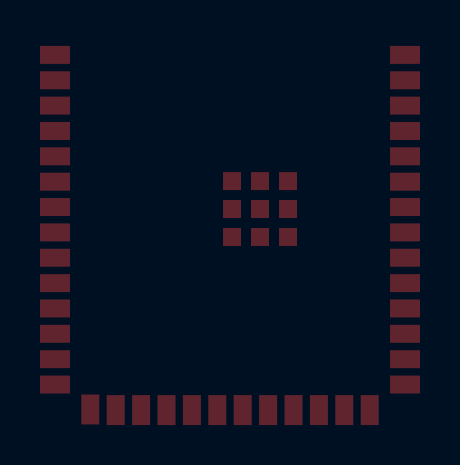
[diagram p3: board, bottom side, seen from below]

No outline. copper layers: Top Layer, Bottom Layer. Coordinates in mm from the lowest, leftmost part position.
Stack: Top Layer 0.035mm / Dielectric1 1.51mm FR4 er 4.5 / Bottom Layer 0.035mm

## Design rules (mm)
template: JLCPCB Capability(Two Layers Board)
spacing copperThickness1oz (default): track to track 0.102, other pairs 0.152 to 0.3
spacing copperThickness2oz: track to track 0.203, other pairs 0.152 to 0.3
track width copperThickness1oz (default): min 0.127, default 0.254, max 2.54
track width copperThickness2oz: min 0.203, default 0.254, max 2.54
differential pair differentialPair (default): width min 0.127, default 0.254, max 2.54; gap min 0.152, default 0.152
via viaSize (default): diameter min 0.5, default 0.61, max 10; hole min 0.3, default 0.305, max 6.3

## Placement (name value [footprint] x y rotation side)
U1  ESP32-S3-WROOM-1U-N16R8  [WIRELM-SMD_ESP32-S3-WROOM-1U]  0 0 0 top

## Footprints (pads in the part's own frame, mm; a bottom-side part is the same pattern mirrored in y, then rotated)
WIRELM-SMD_ESP32-S3-WROOM-1U
  rect 1.5x0.9 smd: 1(-8.75,8.895) 2(-8.75,7.625) 3(-8.75,6.355) 4(-8.75,5.085) 5(-8.75,3.815) 6(-8.75,2.545) 7(-8.75,1.275) 8(-8.75,0.005) 9(-8.75,-1.265) 10(-8.75,-2.535) 11(-8.75,-3.805) 12(-8.75,-5.075) 13(-8.75,-6.345) 14(-8.75,-7.615) 27(8.75,-7.615) 28(8.75,-6.345) 29(8.75,-5.075) 30(8.75,-3.805) 31(8.75,-2.535) 32(8.75,-1.265) 33(8.75,0.005) 34(8.75,1.275) 35(8.75,2.545) 36(8.75,3.815) 37(8.75,5.085) 38(8.75,6.355) 39(8.75,7.625) 40(8.75,8.895)
  rect 0.9x1.5 smd: 15(-6.985,-8.895) 16(-5.715,-8.895) 17(-4.445,-8.895) 18(-3.175,-8.895) 19(-1.905,-8.895) 20(-0.635,-8.895) 21(0.635,-8.895) 22(1.905,-8.895) 23(3.175,-8.895) 24(4.445,-8.895) 25(5.715,-8.895) 26(6.985,-8.865)
  rect 0.9x0.9 smd: 41(-2.9,2.575) 41(-2.9,1.175) 41(-2.9,-0.225) 41(-1.5,2.575) 41(-1.5,1.175) 41(-1.5,-0.225) 41(-0.1,2.575) 41(-0.1,1.175) 41(-0.1,-0.225)

## Nets
As in the schematic.

Pads without a net: U1 1 2 3 4 5 6 7 8 9 10 11 12 13 14 15 16 17 18 19 20 21 22 23 24 25 26 27 28 29 30 31 32 33 34 35 36 37 38 39 40 41

# Board PCB2
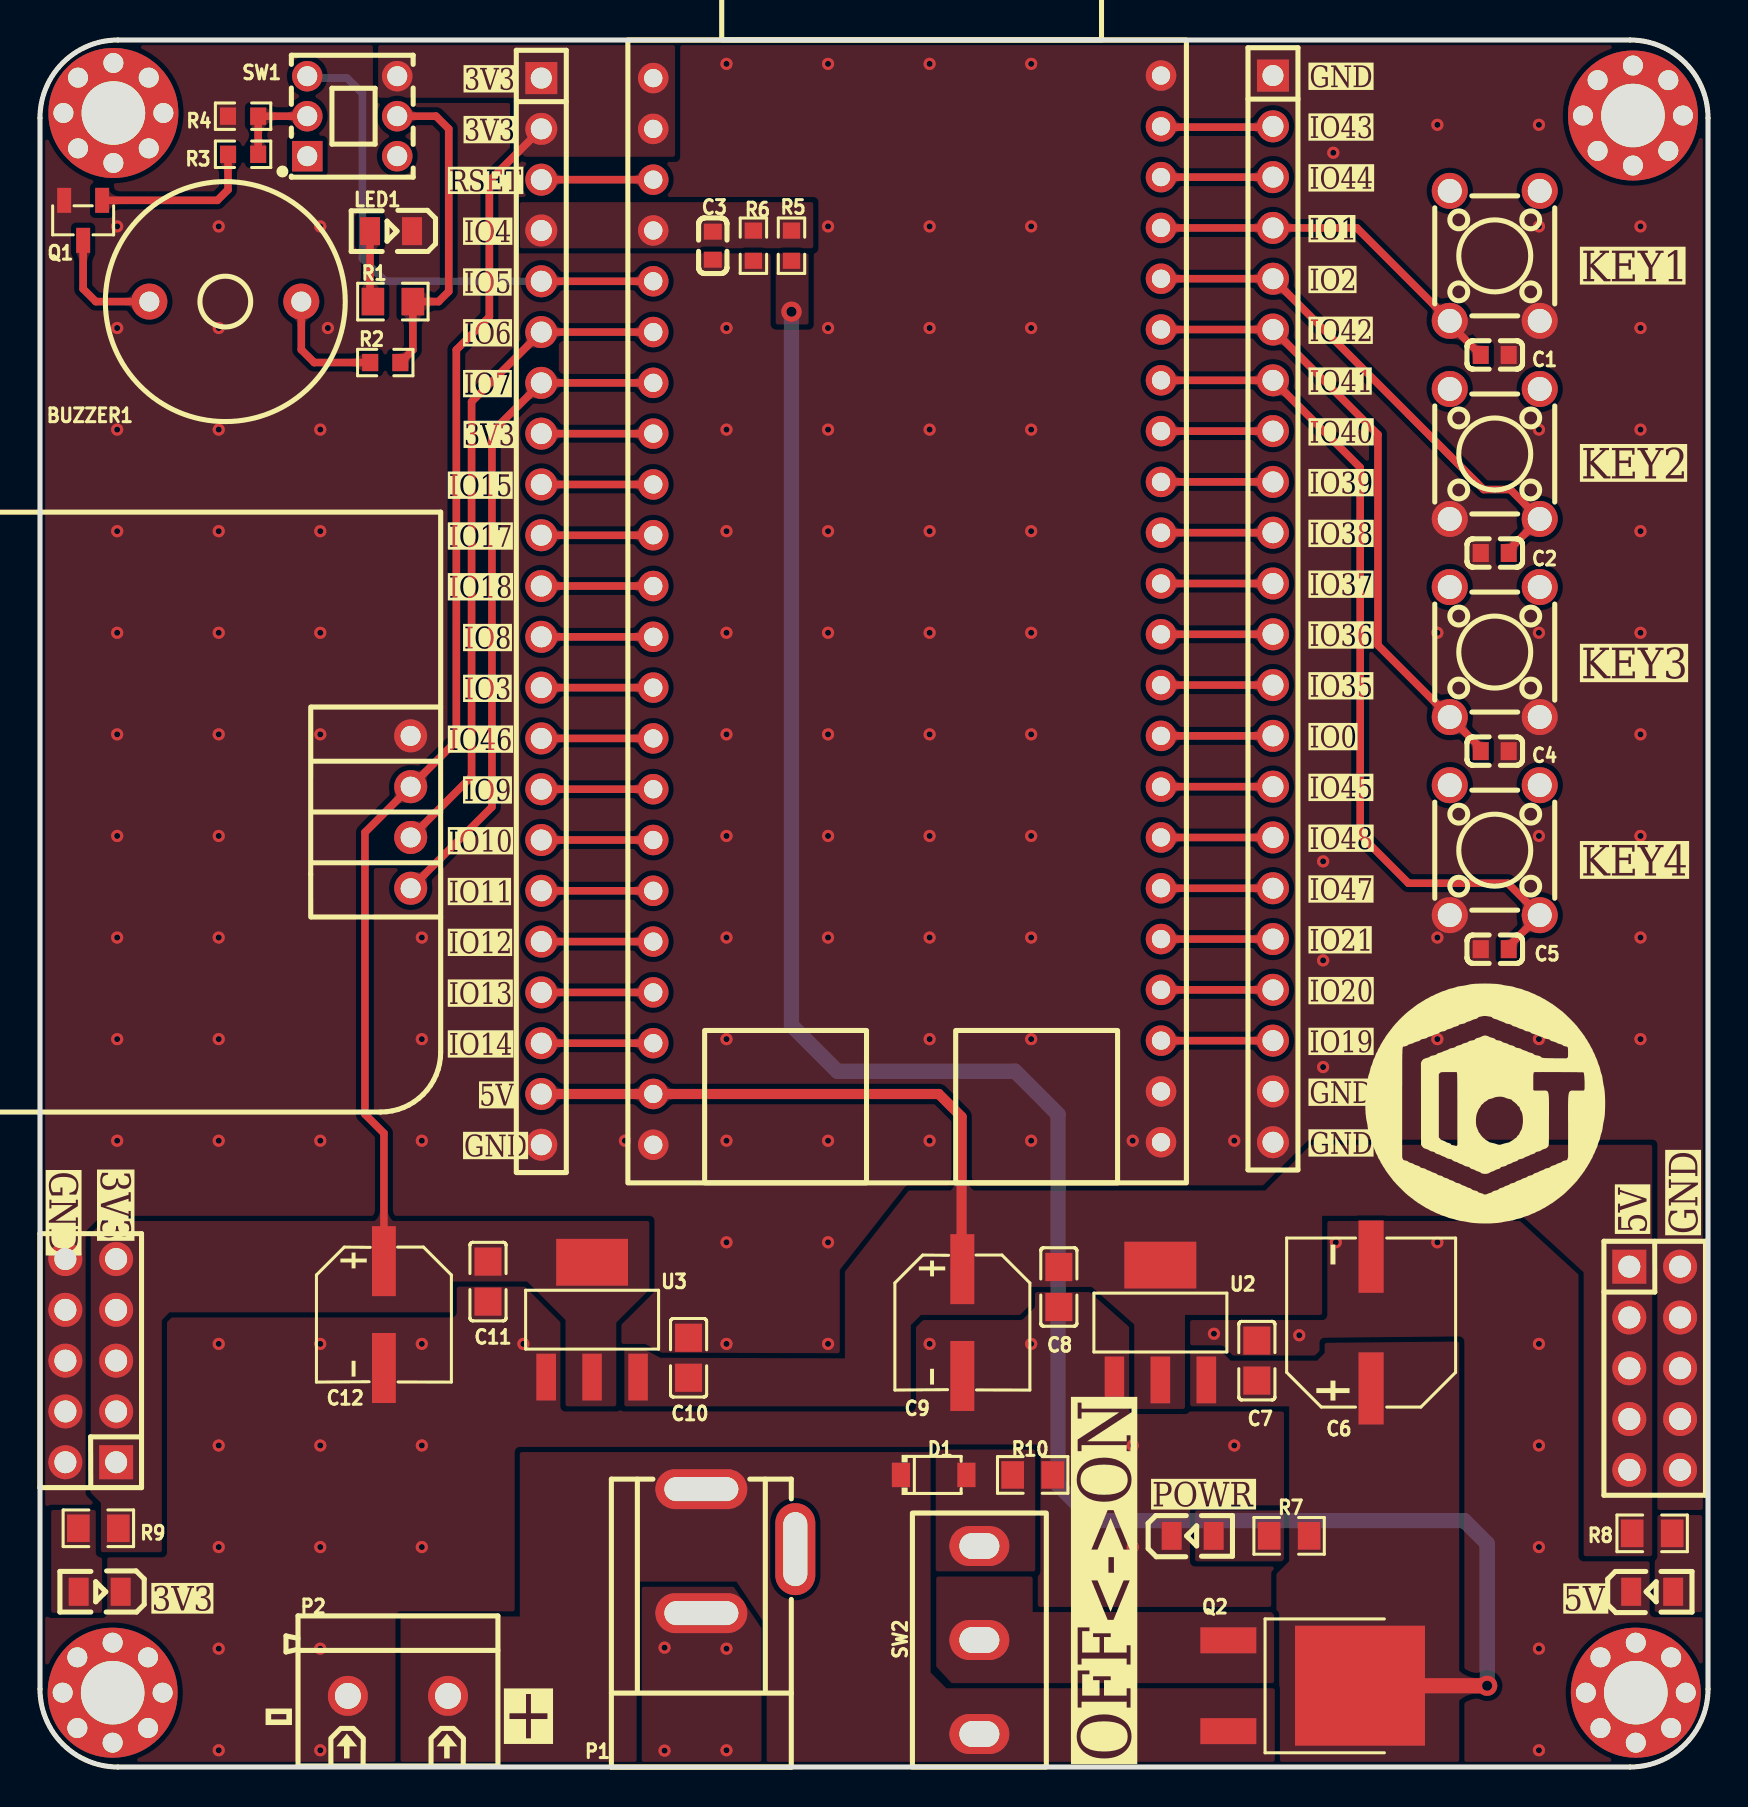
[diagram p4: board, top side]
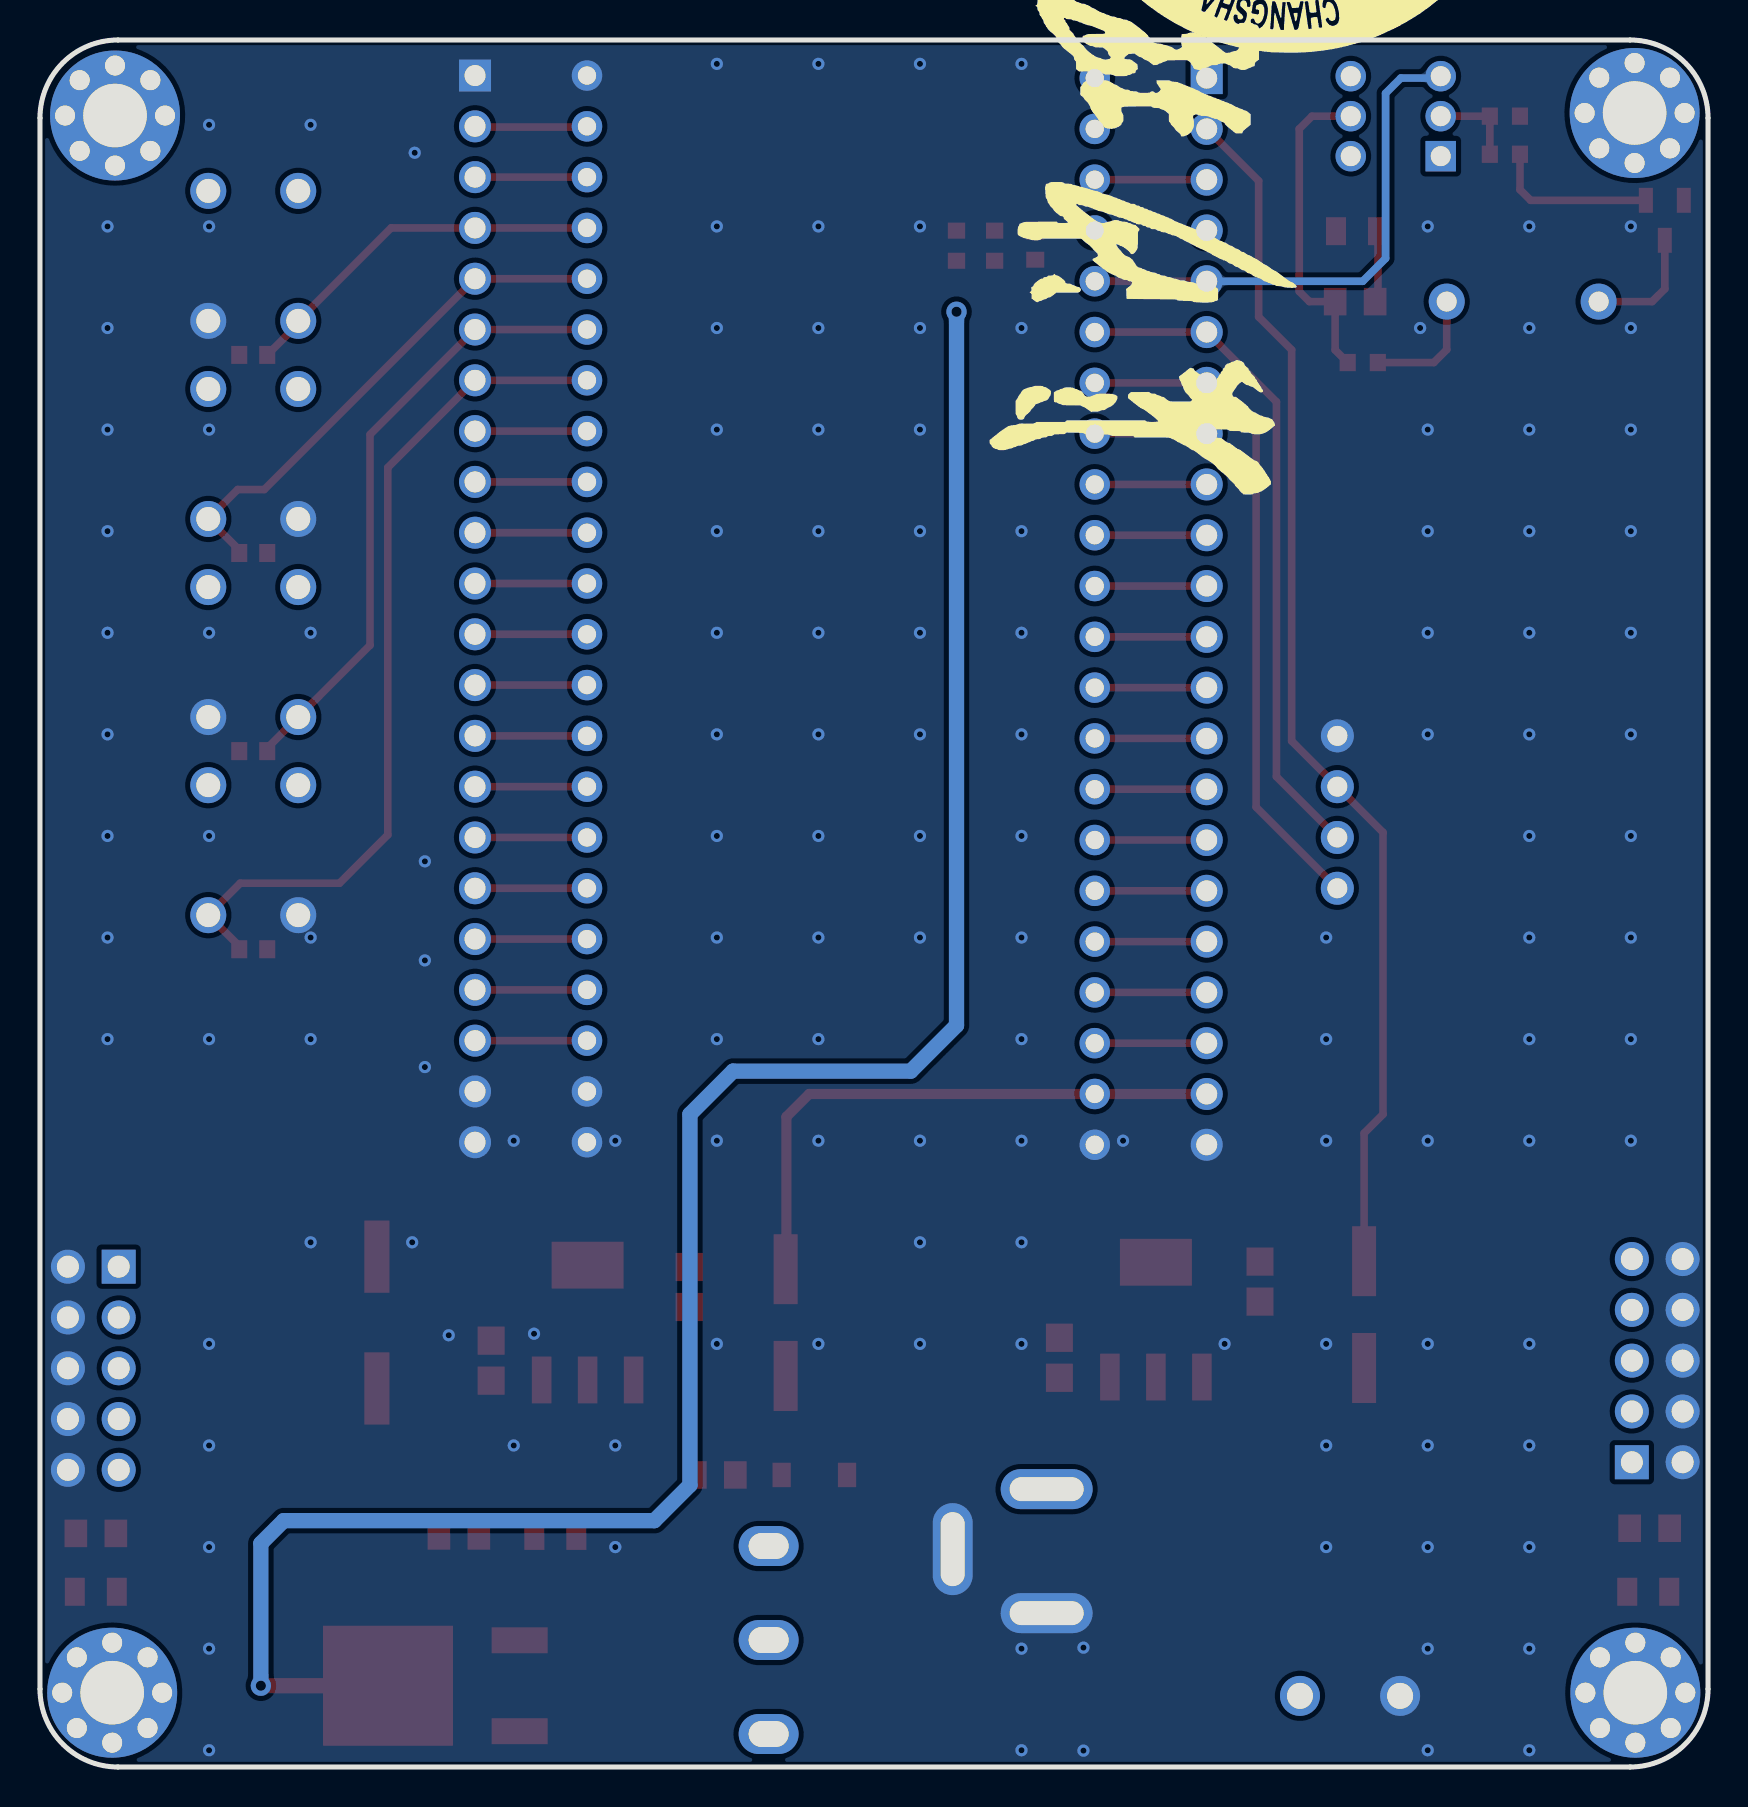
[diagram p5: board, bottom side, seen from below]

Outline 83.44 x 86.36 mm; copper layers: Top Layer, Bottom Layer. Coordinates in mm from the lower left corner of the outline.
Outline path: 0,82.46 0,3.9 arc(1.14,1.14) 3.9,0 79.54,0 arc(82.3,1.14) 83.44,3.9 83.44,82.46 arc(82.3,85.22) 79.54,86.36 3.9,86.36 arc(1.14,85.22) 0,82.46
Stack: Top Layer 0.035mm / Dielectric1 1.51mm FR4 er 4.5 / Bottom Layer 0.035mm

## Design rules (mm)
template: 自定义配置
spacing copperThickness1oz (default): track to track 0.102, other pairs 0.152 to 0.3
spacing copperThickness2oz: track to track 0.203, other pairs 0.152 to 0.3
track width copperThickness1oz (default): min 0.127, default 0.254, max 2.54
track width copperThickness2oz: min 0.203, default 0.254, max 2.54
differential pair differentialPair (default): width min 0.127, default 0.254, max 2.54; gap min 0.152, default 0.152
via viaSize (default): diameter min 0.5, default 0.61, max 10; hole min 0.3, default 0.305, max 6.3

## Placement (name value [footprint] x y rotation side)
3V3  NCD0805R1  [LED0805-R-RD]  2.99 8.76 180 top
5V  NCD0805R1  [LED0805-R-RD]  80.65 8.76 0 top
BUZZER1  2.4kHz  [BUZ-TH_BD12.0-P7.60-D0.6-FD]  9.27 73.28 180 top
C1  100nF  [C0603]  72.77 70.61 0 top
C2  100nF  [C0603]  72.77 60.71 0 top
C3  100nF  [C0603]  33.66 76.07 270 top
C4  100nF  [C0603]  72.77 50.8 0 top
C5  100nF  [C0603]  72.77 40.89 0 top
C6  470uF  [CAP-SMD_BD8.0-L8.3-W8.3-LS9.2-FD-H10.5]  66.59 22.23 90 top
C7  100nF  [C0805]  60.87 20.32 270 top
C8  100nF  [C0805]  50.97 24 90 top
C9  220uF  [CAP-SMD_BD6.3-L6.6-W6.6-FD]  46.14 22.23 270 top
C10  100nF  [C0805]  32.44 20.46 270 top
C11  100nF  [C0805]  22.41 24.27 90 top
C12  220uF  [CAP-SMD_BD6.3-L6.6-W6.6-FD]  17.2 22.62 270 top
D1  BZT52C16  [SOD-123_L2.7-W1.6-LS3.7-RD]  44.7 14.61 0 top
H3  HC-PZ254-11.5L-1x22PZ  [HDR-TH_22P-P2.54-V-M]  25.08 57.79 270 top
H4  HC-PZ254-11.5L-1x22PZ  [HDR-TH_22P-P2.54-V-M]  61.68 57.91 270 top
H5  PZ254V-12-10P  [HDR-TH_10P-P2.54-V-M-R2-C5-S2.54]  80.77 19.94 270 top
H6  PZ254V-12-10P  [HDR-TH_10P-P2.54-V-M-R2-C5-S2.54]  2.54 20.32 90 top
hole1  M3  [m3梅花孔]  3.64 3.72 0 top
hole2  M3  [m3梅花孔]  3.67 82.71 0 top
hole3  M3  [m3梅花孔]  79.69 82.58 0 top
hole4  M3  [m3梅花孔]  79.83 3.72 0 top
KEY1  TS665CJ  [SW-TH_4P-L6.0-W6.0-P4.50-LS6.5]  72.77 75.57 90 top
KEY2  TS665CJ  [SW-TH_4P-L6.0-W6.0-P4.50-LS6.5]  72.77 65.66 90 top
KEY3  TS665CJ  [SW-TH_4P-L6.0-W6.0-P4.50-LS6.5]  72.77 55.75 90 top
KEY4  TS665CJ  [SW-TH_4P-L6.0-W6.0-P4.50-LS6.5]  72.77 45.85 90 top
LED1  NCD0805R1  [LED0805-R-RD]  17.56 76.8 180 top
OLED1  -  [0.96OLED_4P]  18.54 47.75 270 top
P1  DC-005-20A  [DC-IN-TH_DC005]  35.43 10.8 90 top
P2  WJ301V-5.0-2P  [CONN-TH_2P-P5.00_WJ301V-5.00-2P]  17.91 3.56 0 top
POWR  NCD0805R1  [LED0805-R-RD]  57.66 11.56 0 top
Q1  MMS8050-H-TP  [SOT-23-3_L2.9-W1.3-P1.90-LS2.4-BR]  2.16 77.34 90 top
Q2  HY19P03D  [TO-252-2_L6.6-W6.1-P4.57-LS9.9-TL-CW]  62.74 4.06 0 top
R1  1kΩ  [R0805]  17.65 73.28 180 top
R2  10Ω  [R0603]  17.27 70.23 180 top
R3  4.7kΩ  [R0603]  10.16 80.65 0 top
R4  1kΩ  [R0603]  10.16 82.55 180 top
R5  200kΩ  [R0603]  37.59 76.07 270 top
R6  20kΩ  [R0603]  35.69 76.07 270 top
R7  20kΩ  [R0805]  62.48 11.56 180 top
R8  4.7kΩ  [R0805]  80.65 11.68 0 top
R9  1kΩ  [R0805]  2.92 11.94 180 top
R10  10kΩ  [R0805]  49.66 14.61 180 top
SW1  5.8 ZSGT  [SW-TH_5.8ZSGT]  15.62 82.55 270 top
SW2  SS-12D10L5  [SW-TH_SS-12D10L5]  46.99 6.35 90 top
U1  ESP32S3-N16R8开发板  [ESP32S3-N16R8开发板(优信)]  29.41 29.21 0 top
U2  XBL1117-5.0  [SOT-223-3_L6.7-W3.7-P2.30-LS7.0-BR_2]  56.05 22.23 270 top
U3  XBL1117-3.3  [SOT-223-3_L6.7-W3.7-P2.30-LS7.0-BR_2]  27.62 22.37 270 top

## Footprints (pads in the part's own frame, mm; a bottom-side part is the same pattern mirrored in y, then rotated)
0.96OLED_4P
  round 1.65 hole 1: 1(-3.81,-0.002) 2(-1.27,0.002) 3(1.27,0.002) 4(3.81,0.002)
BUZ-TH_BD12.0-P7.60-D0.6-FD
  round 1.8 hole 1: 1(-3.8,0) 2(3.8,0)
C0603
  rect 0.8x0.9 smd: 1(-0.7,0) 2(0.7,0)
C0805
  rect 1.41x1.35 smd: 1(-1,0) 2(1,0)
CAP-SMD_BD6.3-L6.6-W6.6-FD
  rect 3.5x1.2 smd: 1(-2.67,0) 2(2.67,0)
CAP-SMD_BD8.0-L8.3-W8.3-LS9.2-FD-H10.5
  rect 3.61x1.26 smd: 1(-3.295,0) 2(3.295,0)
CONN-TH_2P-P5.00_WJ301V-5.00-2P
  round 2 hole 1.3: 1(-2.505,0) 2(2.505,0)
DC-IN-TH_DC005
  oval 2x4.6 hole 1.2x3.7: 1(3.1,2.35) 2(-3.1,2.35)
  oval 4.6x2 hole 3.7x1.2: 3(0.1,-2.35)
ESP32S3-N16R8开发板(优信)
  round 1.524 hole 0.914: 1(1.27,55.245) 2(1.27,52.705) 3(1.27,50.165) 4(1.27,47.625) 5(1.27,45.085) 6(1.27,42.545) 7(1.27,40.005) 8(1.27,37.465) 9(1.27,34.925) 10(1.27,32.385) 11(1.27,29.845) 12(1.27,27.305) 13(1.27,24.765) 14(1.27,22.225) 15(1.27,19.685) 16(1.27,17.145) 17(1.27,14.605) 18(1.27,12.065) 19(1.27,9.525) 20(1.27,6.985) 21(1.27,4.445) 22(1.27,1.905) 23(26.67,2.032) 24(26.67,4.572) 25(26.67,7.112) 26(26.67,9.652) 27(26.67,12.192) 28(26.67,14.732) 29(26.67,17.272) 30(26.67,19.812) 31(26.67,22.352) 32(26.67,24.892) 33(26.67,27.432) 34(26.67,29.972) 35(26.67,32.512) 36(26.67,35.052) 37(26.67,37.592) 38(26.67,40.132) 39(26.67,42.672) 40(26.67,45.212) 41(26.67,47.752) 42(26.67,50.292) 43(26.67,52.832) 44(26.67,55.372)
HDR-TH_10P-P2.54-V-M-R2-C5-S2.54
  rect 1.7x1.7 hole 1.1: 1(-5.08,-1.27)
  round 1.7 hole 1.1: 2(-5.08,1.27) 3(-2.54,-1.27) 4(-2.54,1.27) 5(0,-1.27) 6(0,1.27) 7(2.54,-1.27) 8(2.54,1.27) 9(5.08,-1.27) 10(5.08,1.27)
HDR-TH_22P-P2.54-V-M
  rect 1.6x1.6 hole 1.05: 1(-26.67,0)
  round 1.6 hole 1.05: 2(-24.13,0) 3(-21.59,0) 4(-19.05,0) 5(-16.51,0) 6(-13.97,0) 7(-11.43,0) 8(-8.89,0) 9(-6.35,0) 10(-3.81,0) 11(-1.27,0) 12(1.27,0) 13(3.81,0) 14(6.35,0) 15(8.89,0) 16(11.43,0) 17(13.97,0) 18(16.51,0) 19(19.05,0) 20(21.59,0) 21(24.13,0) 22(26.67,0)
LED0805-R-RD
  rect 1x1.399 smd: 1(1.05,0) 2(-1.05,0)
m3梅花孔
  round 1 hole 1: 1(-2.5,0) 1(-1.768,1.768) 1(-1.768,-1.768) 1(0,2.5) 1(0,-2.5) 1(1.768,1.768) 1(1.768,-1.768) 1(2.5,0)
  round 6.5 hole 3.18x3.175: 1(0,0)
R0603
  rect 0.806x0.864 smd: 1(-0.753,0) 2(0.753,0)
R0805
  rect 1.133x1.377 smd: 1(-1,0) 2(1,0)
SOD-123_L2.7-W1.6-LS3.7-RD
  rect 0.91x1.22 smd: 1(-1.635,0) 2(1.635,0)
SOT-23-3_L2.9-W1.3-P1.90-LS2.4-BR
  rect 1.25x0.7 smd: 1(1,-0.95) 2(1,0.95) 3(-1,0)
SOT-223-3_L6.7-W3.7-P2.30-LS7.0-BR_2
  rect 2.34x0.98 smd: 1(2.87,-2.3) 2(2.87,0) 3(2.87,2.3)
  rect 2.34x3.6 smd: 2(-2.87,0)
SW-TH_4P-L6.0-W6.0-P4.50-LS6.5
  round 1.8 hole 1.2: 1(-3.25,2.25) 2(3.25,2.25) 3(-3.25,-2.25) 4(3.25,-2.25)
SW-TH_5.8ZSGT
  rect 1.524x1.524 hole 1: 1(2,-2.25)
  round 1.524 hole 1: 2(0,-2.25) 3(-2,-2.25) 4(2,2.25) 5(0,2.25) 6(-2,2.25)
SW-TH_SS-12D10L5
  oval 2x3 hole 1.3x2: 1(-4.7,0) 2(0,0) 3(4.7,0)
TO-252-2_L6.6-W6.1-P4.57-LS9.9-TL-CW
  rect 2.8x1.3 smd: 1(-3.292,2.273) 3(-3.292,-2.273)
  rect 6.5x6 smd: 2(3.292,0)

## Nets
As in the schematic, except:
3V3: C11.2 C12.1 H3.1 H3.2 H6.1 H6.3 H6.5 H6.7 H6.9 OLED1.2 R9.1 SW1.6 U1.1 U1.2 U3.2
GND: 3V3.2 5V.2 C1.2 C2.1 C3.2 C4.2 C5.1 C6.2 C7.1 C8.1 C9.2 C10.1 C11.1 C12.2 H3.22 H4.1 H4.21 H4.22 H5.2 H5.4 H5.6 H5.8 H5.10 H6.2 H6.4 H6.6 H6.8 H6.10 KEY1.3 KEY2.1 KEY3.3 KEY4.1 LED1.2 OLED1.1 P1.2 P1.3 P2.1 POWR.2 Q1.2 R4.2 R6.2 R10.1 U1.22 U1.23 U1.24 U1.44 U2.1 U3.1
IO6: H3.6 OLED1.3 U1.6
IO7: H3.7 OLED1.4 U1.7
$1N3311: POWR.1 R7.2
$1N3312: 5V.1 R8.2
$1N3313: 3V3.1 R9.2

Pads without a net: hole1 1; hole2 1; hole3 1; hole4 1; KEY1 2 4; KEY2 2 4; KEY3 2 4; KEY4 2 4; SW1 1 4

## Via types
v1: diameter 0.61, hole 0.305, Top Layer to Bottom Layer, 134 vias
v2: diameter 1.016, hole 0.508, Top Layer to Bottom Layer, 2 vias

## Routing (per net, layer and track width the routed paths; a pad name or vN(x,y) marks a point on that pad's centre or on a via; arc(x,y) is an arc through that point)
3V3: length 60.7
  Top Layer w0.381: H3.2 22.48,79.32 22.48,72.52 20.83,70.87 20.83,51.31 OLED1.2 16.26,46.73 16.26,32.64 17.2,31.69 C12.1
5V: length 29.1
  Top Layer w0.508: C9.1 46.1,24.93 46.1,32.51 44.96,33.66 H3.21
GND:
  vias: v1(3.86,77.04) v1(3.86,71.96) v1(3.86,66.88) v1(3.86,61.8) v1(3.86,56.72) v1(3.86,51.64) v1(3.86,46.56) v1(3.86,41.48) v1(3.86,36.4) v1(3.86,31.32) v1(8.94,77.04) v1(8.94,71.96) v1(8.94,66.88) v1(8.94,61.8) v1(8.94,56.72) v1(8.94,51.64) v1(8.94,46.56) v1(8.94,41.48) v1(8.94,36.4) v1(8.94,31.32) v1(8.94,21.16) v1(8.94,16.08) v1(8.94,11) v1(8.94,5.92) v1(8.94,0.84) v1(14.02,77.04) v1(14.02,66.88) v1(14.02,61.8) v1(14.02,56.72) v1(14.02,51.64) v1(14.02,31.32) v1(14.02,21.16) v1(14.02,16.08) v1(14.02,11) v1(14.02,5.92) v1(14.02,0.84) v1(14.4,71.96) v1(19.1,41.48) v1(19.1,36.4) v1(19.1,31.32) v1(19.1,21.16) v1(19.1,16.08) v1(19.1,11) v1(24.18,21.16) v1(29.26,31.32) v1(31.24,5.97) v1(31.24,0.82) v1(34.34,85.17) v1(34.34,71.96) v1(34.34,66.88) v1(34.34,61.8) v1(34.34,56.72) v1(34.34,51.64) v1(34.34,46.56) v1(34.34,41.48) v1(34.34,36.4) v1(34.34,31.32) v1(34.34,26.24) v1(34.34,21.16) v1(34.34,5.92) v1(34.34,0.84) v1(39.42,85.17) v1(39.42,77.04) v1(39.42,71.96) v1(39.42,66.88) v1(39.42,61.8) v1(39.42,56.72) v1(39.42,51.64) v1(39.42,46.56) v1(39.42,41.48) v1(39.42,31.32) v1(39.42,26.24) v1(39.42,21.16) v1(44.5,85.17) v1(44.5,77.04) v1(44.5,71.96) v1(44.5,66.88) v1(44.5,61.8) v1(44.5,56.72) v1(44.5,51.64) v1(44.5,46.56) v1(44.5,41.48) v1(44.5,36.4) v1(44.5,31.32) v1(44.5,21.16) v1(49.58,85.17) v1(49.58,77.04) v1(49.58,71.96) v1(49.58,66.88) v1(49.58,61.8) v1(49.58,56.72) v1(49.58,51.64) v1(49.58,46.56) v1(49.58,41.48) v1(49.58,36.4) v1(49.58,31.32) v1(49.58,21.16) v1(54.66,31.32) v1(54.66,16.08) v1(54.66,11) v1(58.72,21.67) v1(59.74,31.32) v1(59.74,16.08) v1(62.99,21.59) v1(64.19,45.29) v1(64.19,40.34) v1(64.19,35) v1(64.69,80.72) v1(64.82,26.24) v1(69.9,82.12) v1(69.9,56.72) v1(69.9,41.48) v1(69.9,36.4) v1(69.9,26.24) v1(74.98,82.12) v1(74.98,77.04) v1(74.98,66.88) v1(74.98,56.72) v1(74.98,46.56) v1(74.98,36.4) v1(74.98,21.16) v1(74.98,16.08) v1(74.98,11) v1(74.98,5.92) v1(74.98,0.84) v1(80.06,77.04) v1(80.06,71.96) v1(80.06,66.88) v1(80.06,61.8) v1(80.06,56.72) v1(80.06,51.64) v1(80.06,46.56) v1(80.06,41.48) v1(80.06,36.4)
VCCBAT: length 105.6
  Top Layer w0.762: Q2.2 v2(72.39,4.06)
  Bottom Layer w0.762: v2(72.39,4.06) 72.39,11.18 71.25,12.32 52.71,12.32 50.93,14.1 50.93,32.64 48.77,34.8 39.88,34.8 37.59,37.08 v2(37.59,72.77)
BUZZ_PIN: length 4.4
  Top Layer w0.381: SW1.2 R4.1 R3.2
BUZZ_PW: length 16.3
  Top Layer w0.381: SW1.5 19.81,82.55 20.45,81.92 20.45,73.79 19.94,73.28 18.65,73.28 18.65,70.86 R2.1
IO0: length 5.6
  Top Layer w0.381: U1.31 H4.14
IO1: length 18.7
  Top Layer w0.381: 56.08,76.96 H4.4 65.87,76.96 KEY1.1 70.52,72.16 C1.1
IO2: length 26.3
  Top Layer w0.381: U1.40 H4.5 72.22,63.88 73.55,63.88 KEY2.3 73.47,60.86 73.47,60.71
IO3: length 5.6
  Top Layer w0.381: H3.13 30.68,53.98
IO5: length 26.4
  Top Layer w0.381: H3.5 30.68,74.3
  Bottom Layer w0.381: H3.5 17.27,74.3 16.13,75.44 16.13,83.69 15.37,84.46 13.47,84.46 SW1.3
IO6: length 33.6
  Top Layer w0.381: OLED1.3 21.59,49.53 21.59,68.27 H3.6 30.68,71.76
IO7: length 33.6
  Top Layer w0.381: OLED1.4 22.61,48 22.61,66.74 H3.7 30.68,69.22
IO8: length 5.6
  Top Layer w0.381: H3.12 30.68,56.52
IO9: length 5.6
  Top Layer w0.381: H3.15 30.68,48.9
IO10: length 5.6
  Top Layer w0.381: H3.16 30.68,46.36
IO11: length 5.6
  Top Layer w0.381: H3.17 30.68,43.82
IO12: length 5.6
  Top Layer w0.381: H3.18 30.68,41.28
IO13: length 5.6
  Top Layer w0.381: H3.19 30.68,38.74
IO14: length 5.6
  Top Layer w0.381: H3.20 30.68,36.2
IO15: length 5.6
  Top Layer w0.381: H3.8 30.68,66.68
IO16: length 5.6
  Top Layer w0.381: H3.9 30.68,64.14
IO17: length 5.6
  Top Layer w0.381: H3.10 30.68,61.6
IO18: length 5.6
  Top Layer w0.381: H3.11 30.68,59.06
IO19: length 5.6
  Top Layer w0.381: U1.25 H4.20
IO20: length 5.6
  Top Layer w0.381: U1.26 H4.19
IO21: length 5.6
  Top Layer w0.381: 56.08,41.4 H4.18
IO35: length 5.6
  Top Layer w0.381: U1.32 H4.13
IO36: length 5.6
  Top Layer w0.381: U1.33 H4.12
IO37: length 5.6
  Top Layer w0.381: 56.08,59.18 H4.11
IO38: length 5.6
  Top Layer w0.381: U1.35 H4.10
IO39: length 5.6
  Top Layer w0.381: U1.36 H4.9
IO40: length 5.6
  Top Layer w0.381: U1.37 H4.8
IO41: length 43.1
  Top Layer w0.381: U1.38 H4.7 66.04,64.98 66.04,46.61 68.45,44.2 73.42,44.2 KEY4.3 73.47,41.05 73.47,40.89
IO42: length 31
  Top Layer w0.381: U1.39 H4.6 66.93,66.63 66.93,56.1 KEY3.1 72.07,50.95 C4.1
IO43(TX): length 5.6
  Top Layer w0.381: U1.43 56.12,82 61.64,82 H4.2
IO44(RX): length 5.6
  Top Layer w0.381: U1.42 H4.3
IO45: length 5.6
  Top Layer w0.381: U1.30 H4.15
IO46: length 5.6
  Top Layer w0.381: H3.14 30.68,51.44
IO47: length 5.6
  Top Layer w0.381: U1.28 H4.17
IO48: length 5.6
  Top Layer w0.381: U1.29 H4.16
REST: length 5.6
  Top Layer w0.381: H3.3 30.68,79.38
$1N8711: length 8.3
  Top Layer w0.381: 3.11,78.34 8.87,78.34 9.41,78.88 R3.1
$1N8713: length 6
  Top Layer w0.381: BUZZER1.2 2.79,73.28 2.16,73.91 Q1.3
$1N8714: length 6.1
  Top Layer w0.381: BUZZER1.1 13.07,70.88 13.72,70.23 R2.2
$1N9371: length 3.6
  Top Layer w0.381: LED1.1 16.51,73.42 R1.2

## Copper pours and planes (outline as drawn; the poured copper is in the pictures)
3V3 on Top Layer: 16.91,86.21 16.91,83.47 23.77,83.47 23.77,81 24.26,80.52 31.77,80.52 31.77,86.21
3V3 on Top Layer: 28.83,18.03 28.83,22.23 30.48,23.88 30.48,27.31 3.17,27.31 2.54,26.67 2.54,13.72 3.05,13.21 3.05,10.74 6.1,10.74 6.1,10.8 6.1,22.35 6.48,22.73 20.59,22.73 20.59,24.27 24.37,24.27 26.29,22.35 26.29,18.03
5V on Top Layer: 31.03,20.46 30.21,20.9 29.23,20.9 29.23,18.03 43.56,18.03 43.56,22.1 44.07,22.61 49.02,22.61 49.52,23.1 49.52,24 52.61,24 54.74,22.12 54.74,17.91 57.28,17.91 57.28,22.61 64.13,22.61 64.13,27.56 74.13,27.56 77.22,24.74 77.22,10.54 80.65,10.54 80.65,31.12 63.57,31.12 61.29,28.83 43.46,28.83 40.26,24.77 40.26,20.43
GND on Top Layer: -7.87,94.11 91.57,94.11 91.57,-10.16 -7.87,-10.16
GND on Bottom Layer: -1.27,92.08 88.14,92.08 88.14,-5.21 -1.27,-5.21
VCCBAT on Top Layer: 61.85,0.25 70.99,0.25 70.99,21.27 64.26,21.21 64.26,20.72 64.13,20.57 63.88,20.32 59.56,20.32 59.06,20.83 57.53,20.83 57.53,18.03 62.48,18.03 62.48,10.29 61.85,9.65
VCCBAT on Top Layer: 36.8,75.52 36.8,72.16 36.83,72.14 38.45,72.14 38.45,75.53 38.45,75.83 36.8,75.82
IO4 on Top Layer: 24,75.95 38.68,75.95 38.68,78.25 24,78.25
$1N2876 on Top Layer: 44.7,15.88 44.7,9.78 49.79,9.78 49.79,15.88
$1N2878 on Top Layer: 44.83,9.53 44.83,5.02 45.73,4.06 61.73,4.06 61.73,7.61 61.59,7.75 49.66,7.75 49.66,9.53
$1N2879 on Top Layer: 44.55,15.75 44.55,4.72 45.34,3.94 61.77,3.94 61.77,0.05 61.72,0 36.35,0 36.35,7.02 34.83,9.27 29.84,9.27 29.84,0 28.83,0 28.77,0.06 18.04,0.06 18.04,7.53 24,7.53 24,15.75
$1N3311 on Top Layer: 57.78,12.83 62.23,12.83 62.23,10.29 57.78,10.29
$1N3312 on Top Layer: 80.77,12.6 83.15,12.6 83.15,7.75 80.77,7.75
$1N3313 on Top Layer: 0.56,12.86 3.11,12.86 3.11,7.71 0.56,7.71

Small or netless copper shapes (teardrops, artwork), in the pictures only: 118 on Top Layer, 4 on Bottom Layer

## Text on the board
Top Silkscreen Layer: 5V | GND | 3V3 | - | + | OFF<->ON | RSET | IO15 | IO17 | IO18 | IO46 | IO10 | IO11 | IO12 | IO13 | IO14 | IO4 | IO5 | IO6 | IO7 | IO8 | IO3 | IO9 | IO43 | IO44 | IO1 | IO2 | IO42 | IO41 | IO40 | IO39 | IO38 | IO37 | IO36 | IO35 | IO0 | IO45 | IO48 | IO47 | IO21 | IO20 | IO19
